# Altium schematic sheet MT-PowerDispatch V1.0.0.SchDoc
size E; SheetNumber: 0; SheetTotal: 0
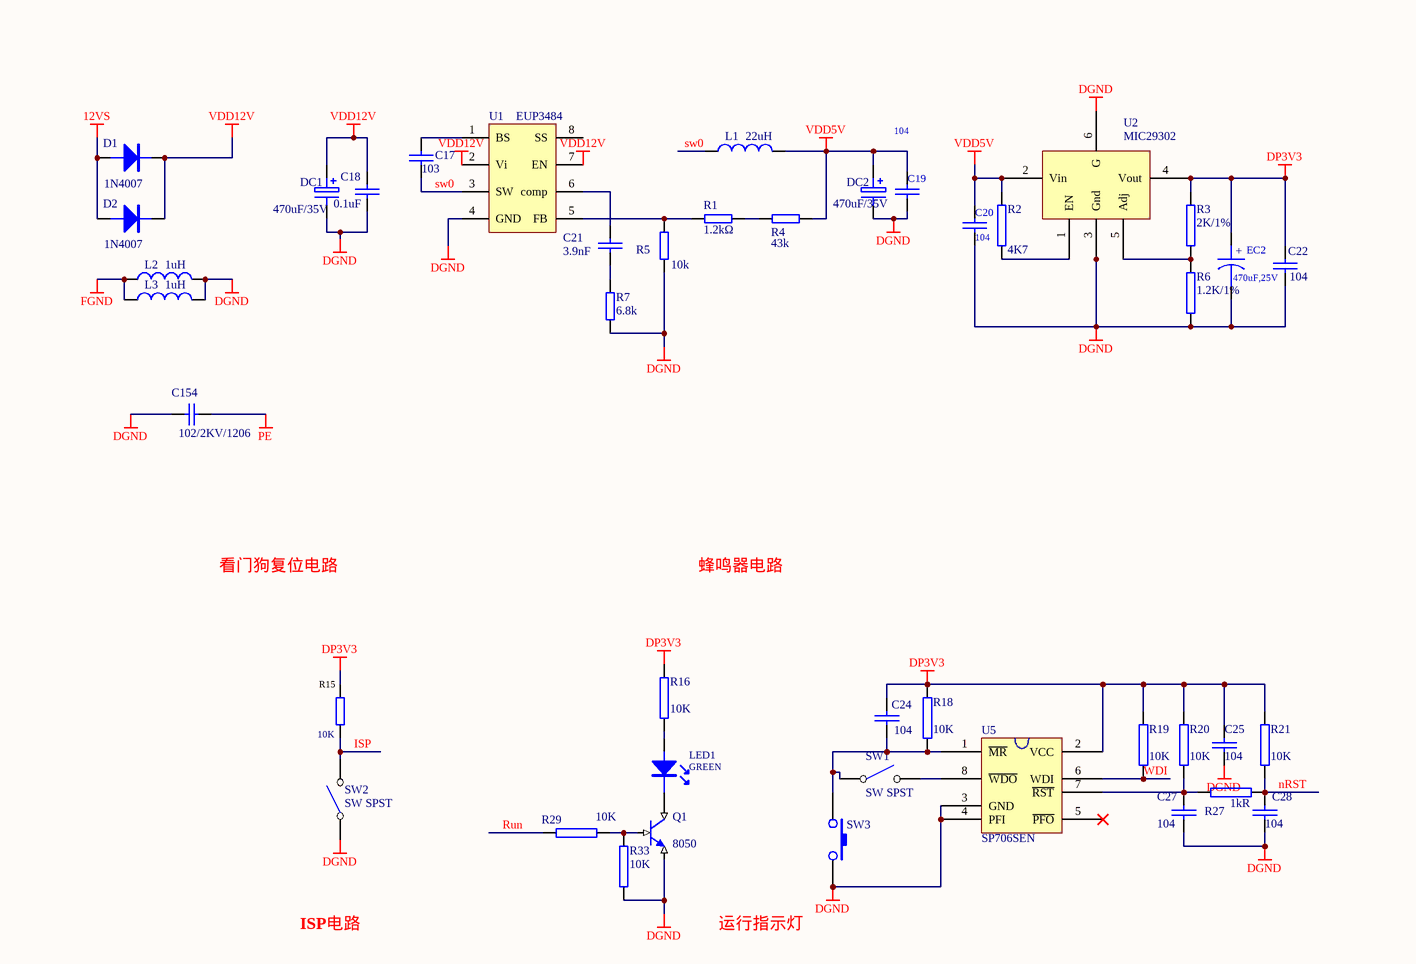
[diagram p0: MT-PowerDispatch V1.0.0.SchDoc, top left]
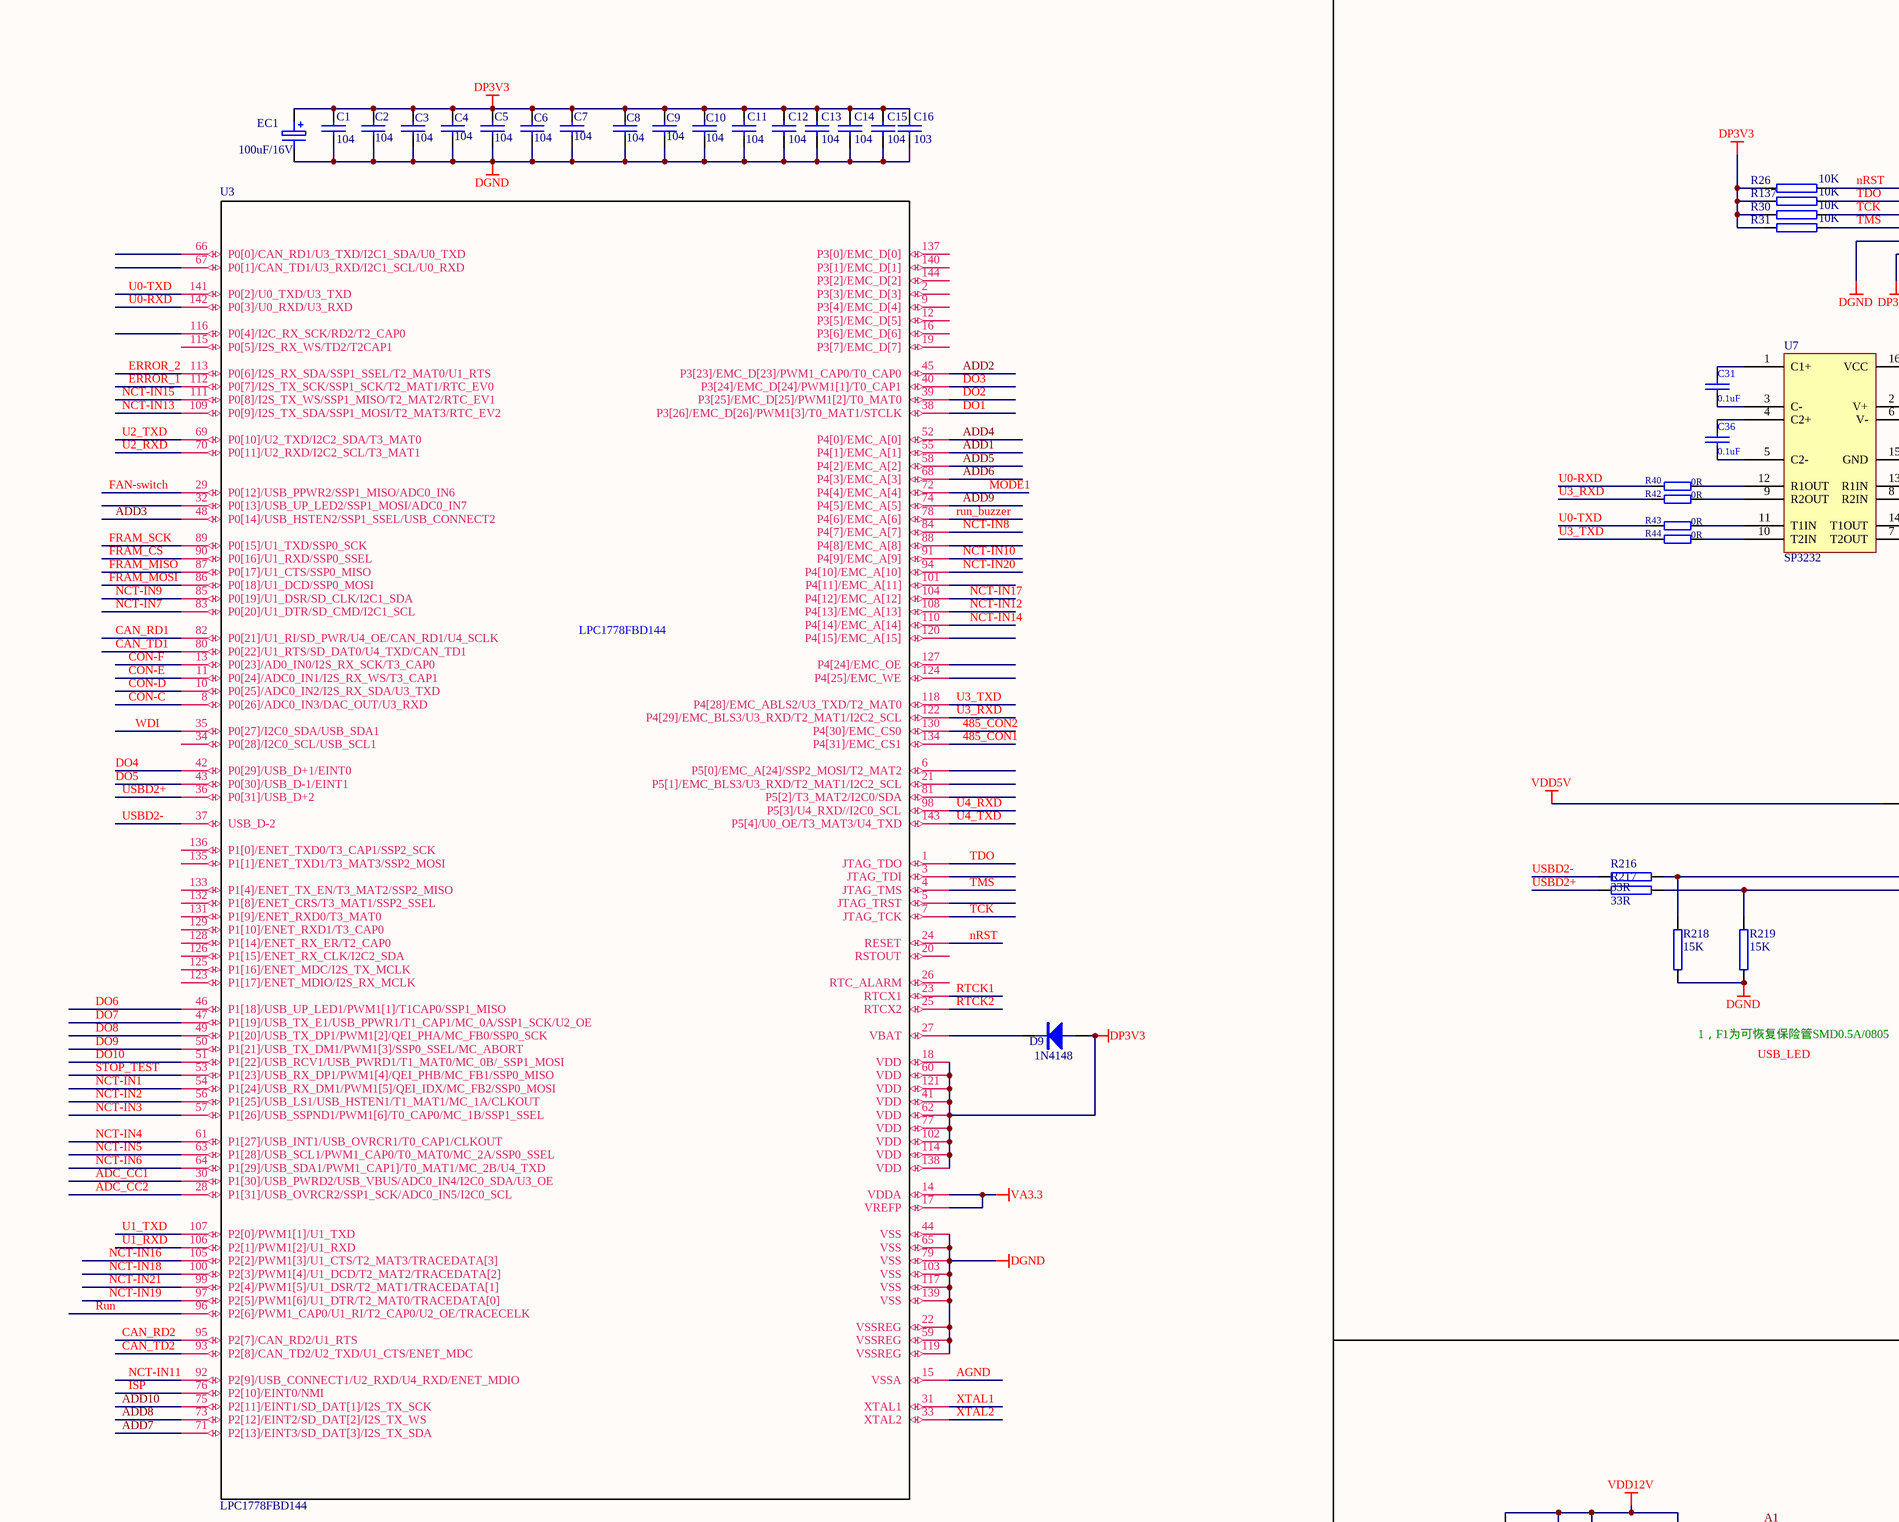
[diagram p1: MT-PowerDispatch V1.0.0.SchDoc, top middle]
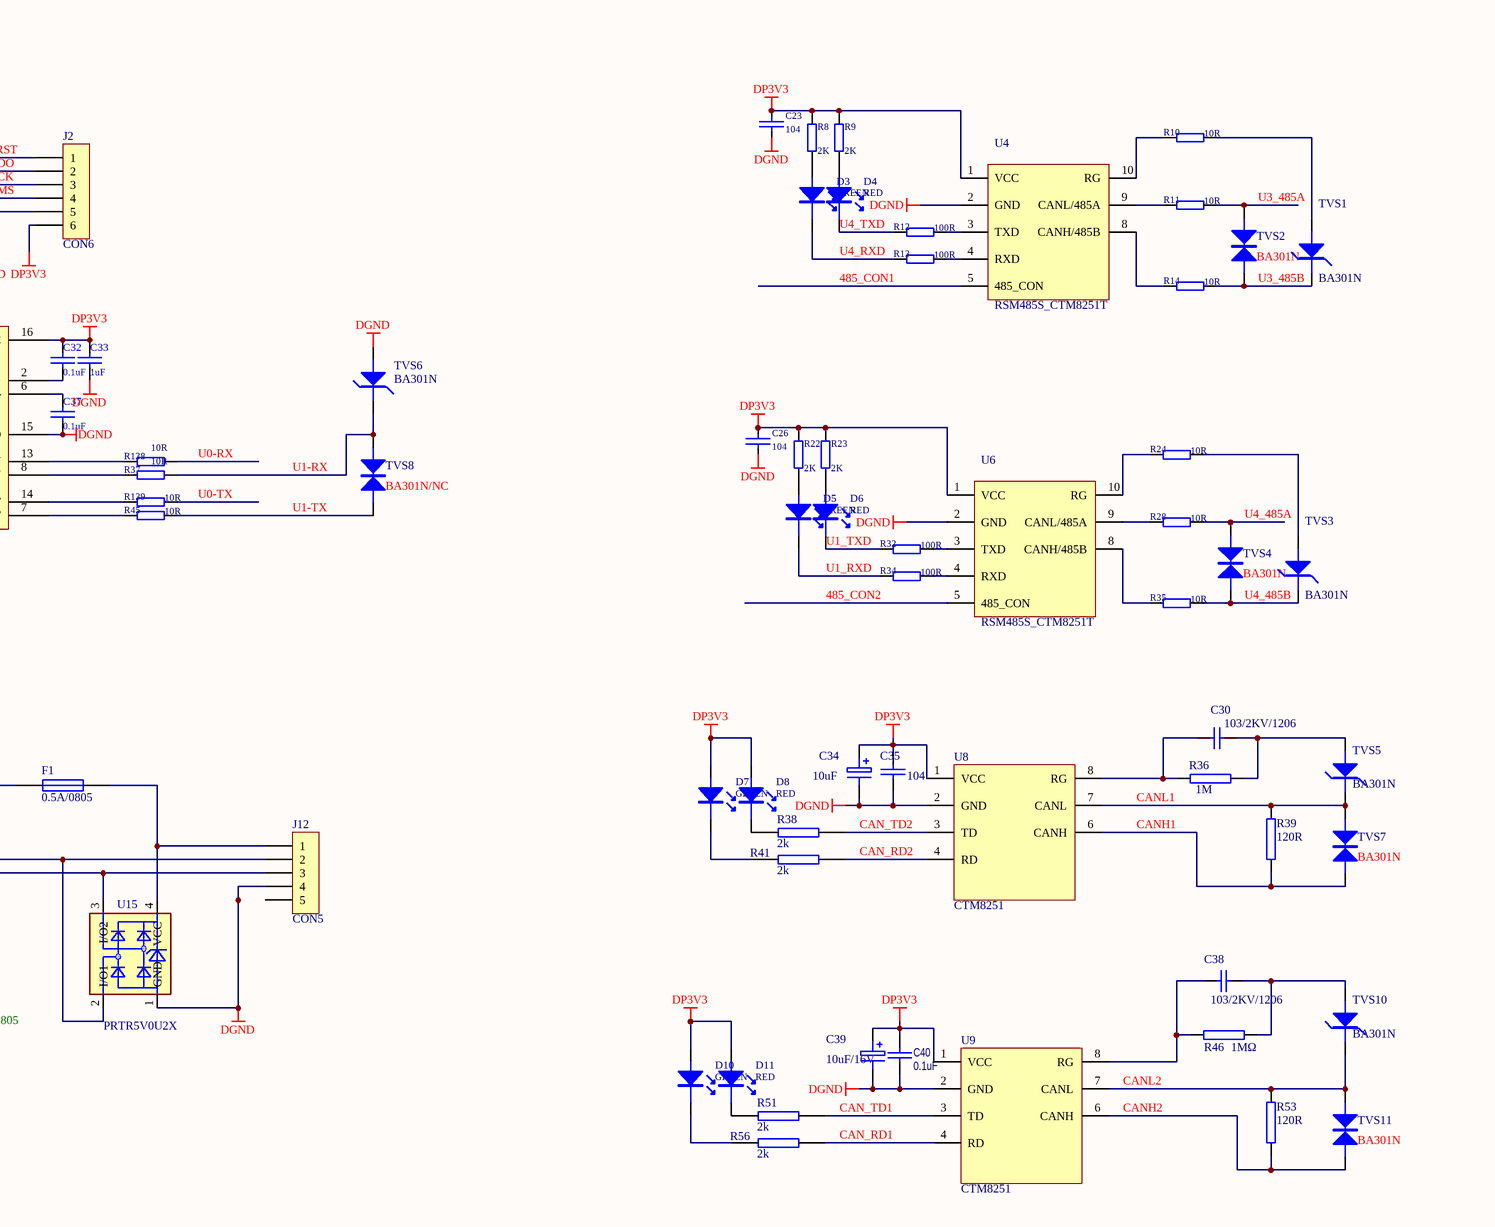
[diagram p2: MT-PowerDispatch V1.0.0.SchDoc, top right]
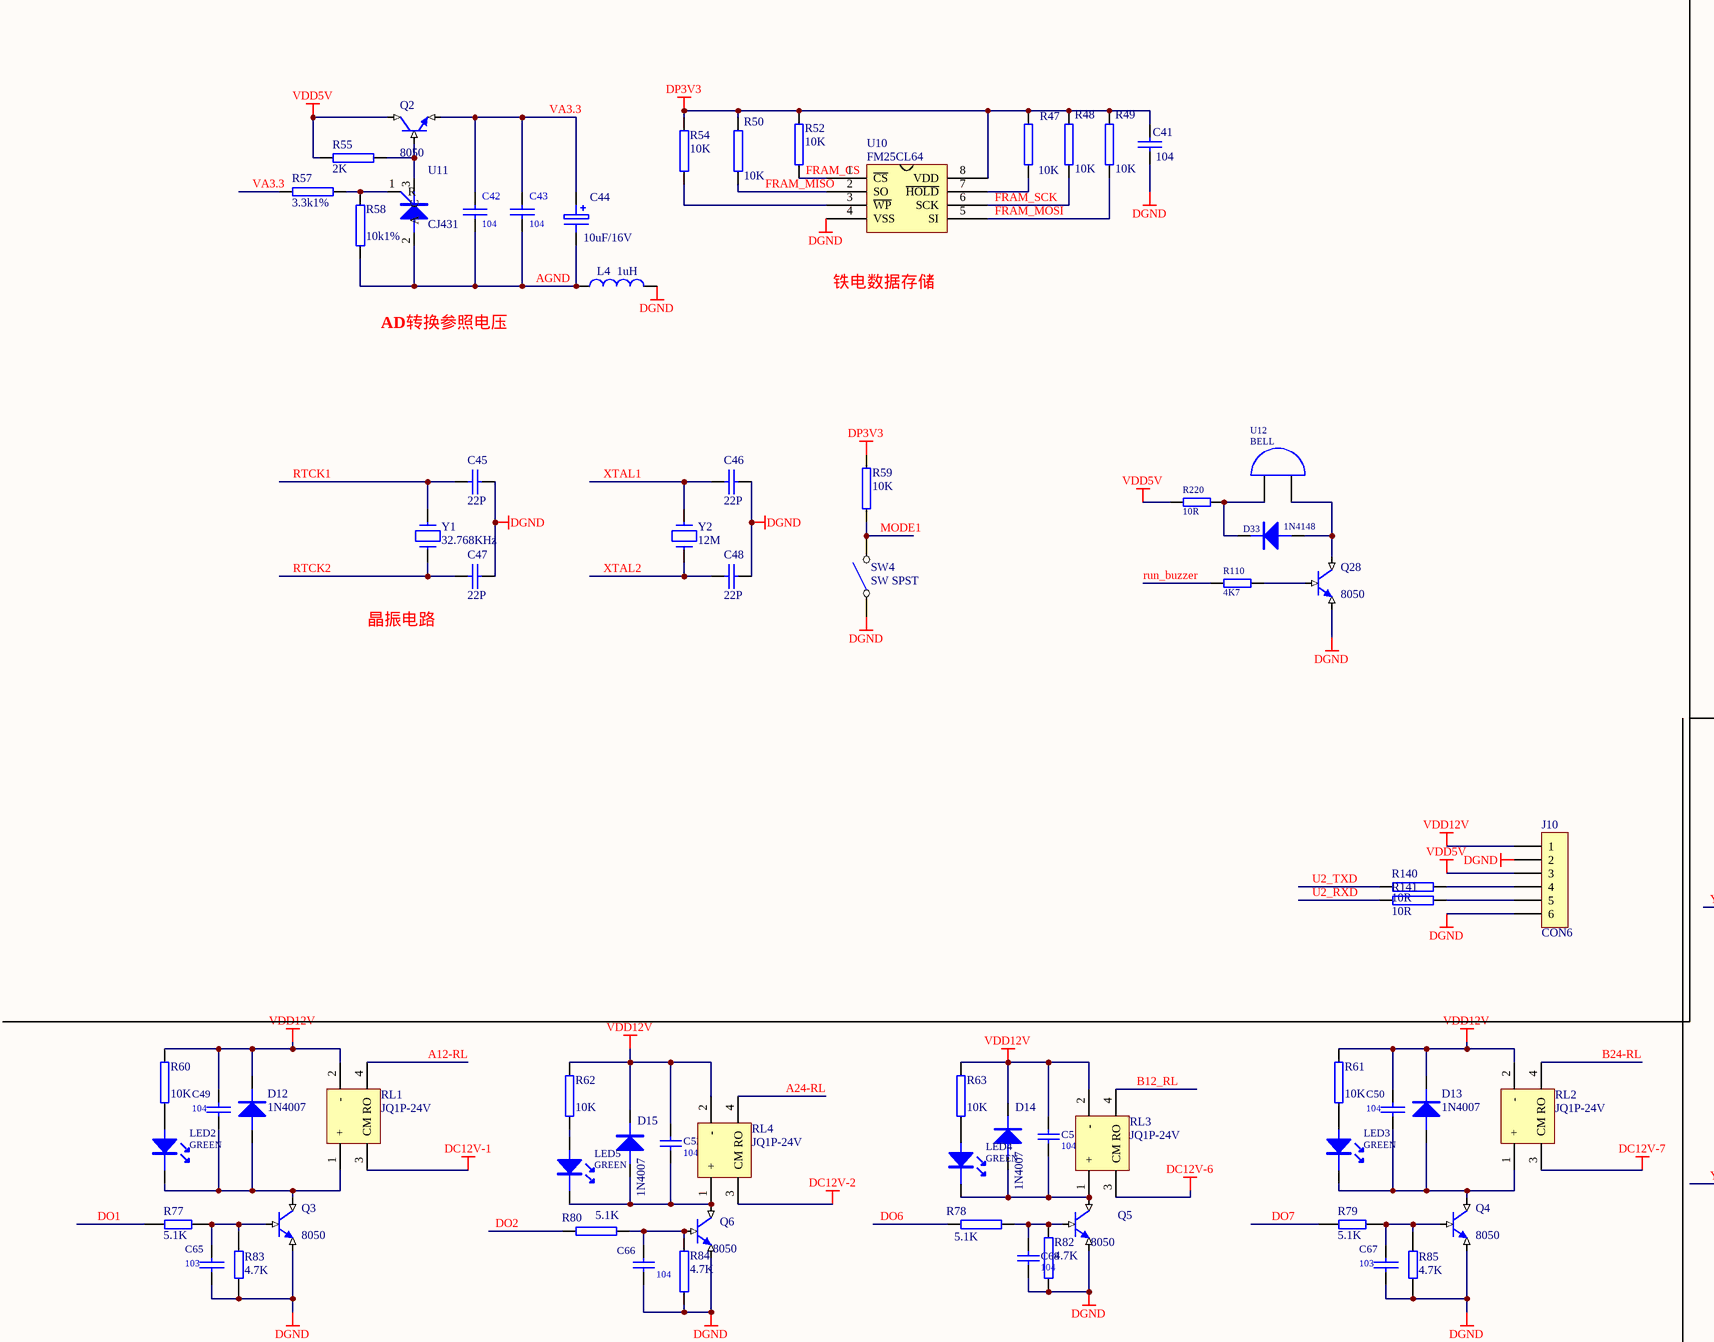
[diagram p3: MT-PowerDispatch V1.0.0.SchDoc, centre left]
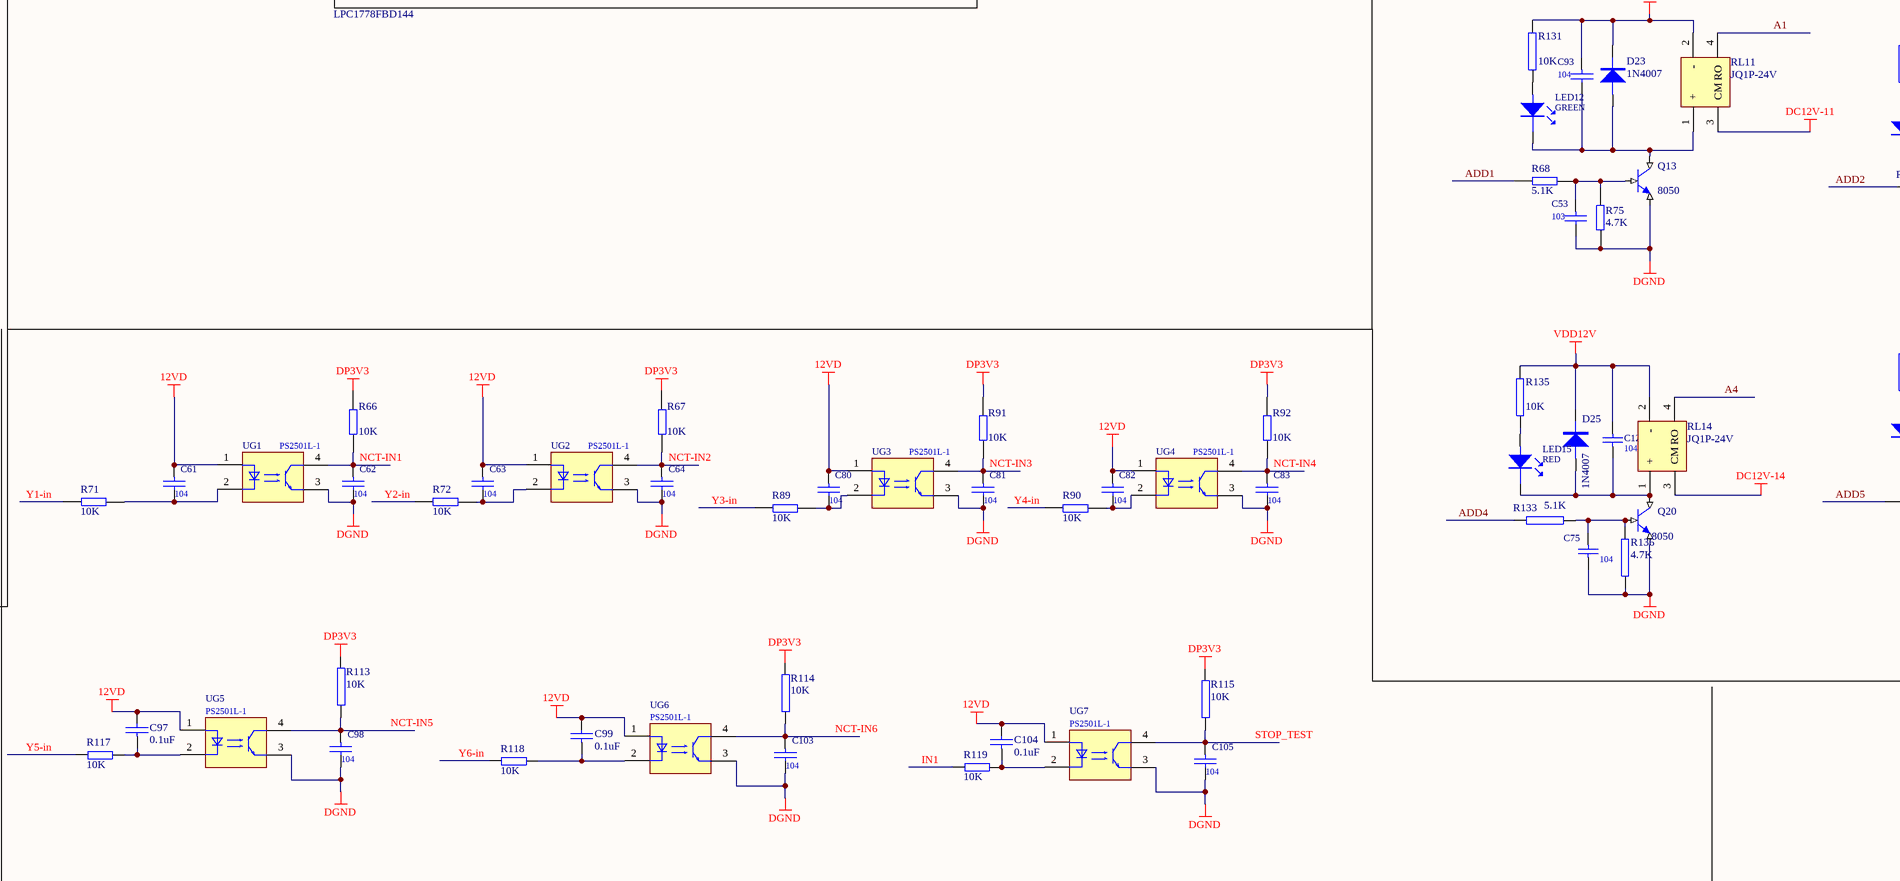
[diagram p4: MT-PowerDispatch V1.0.0.SchDoc, centre middle]
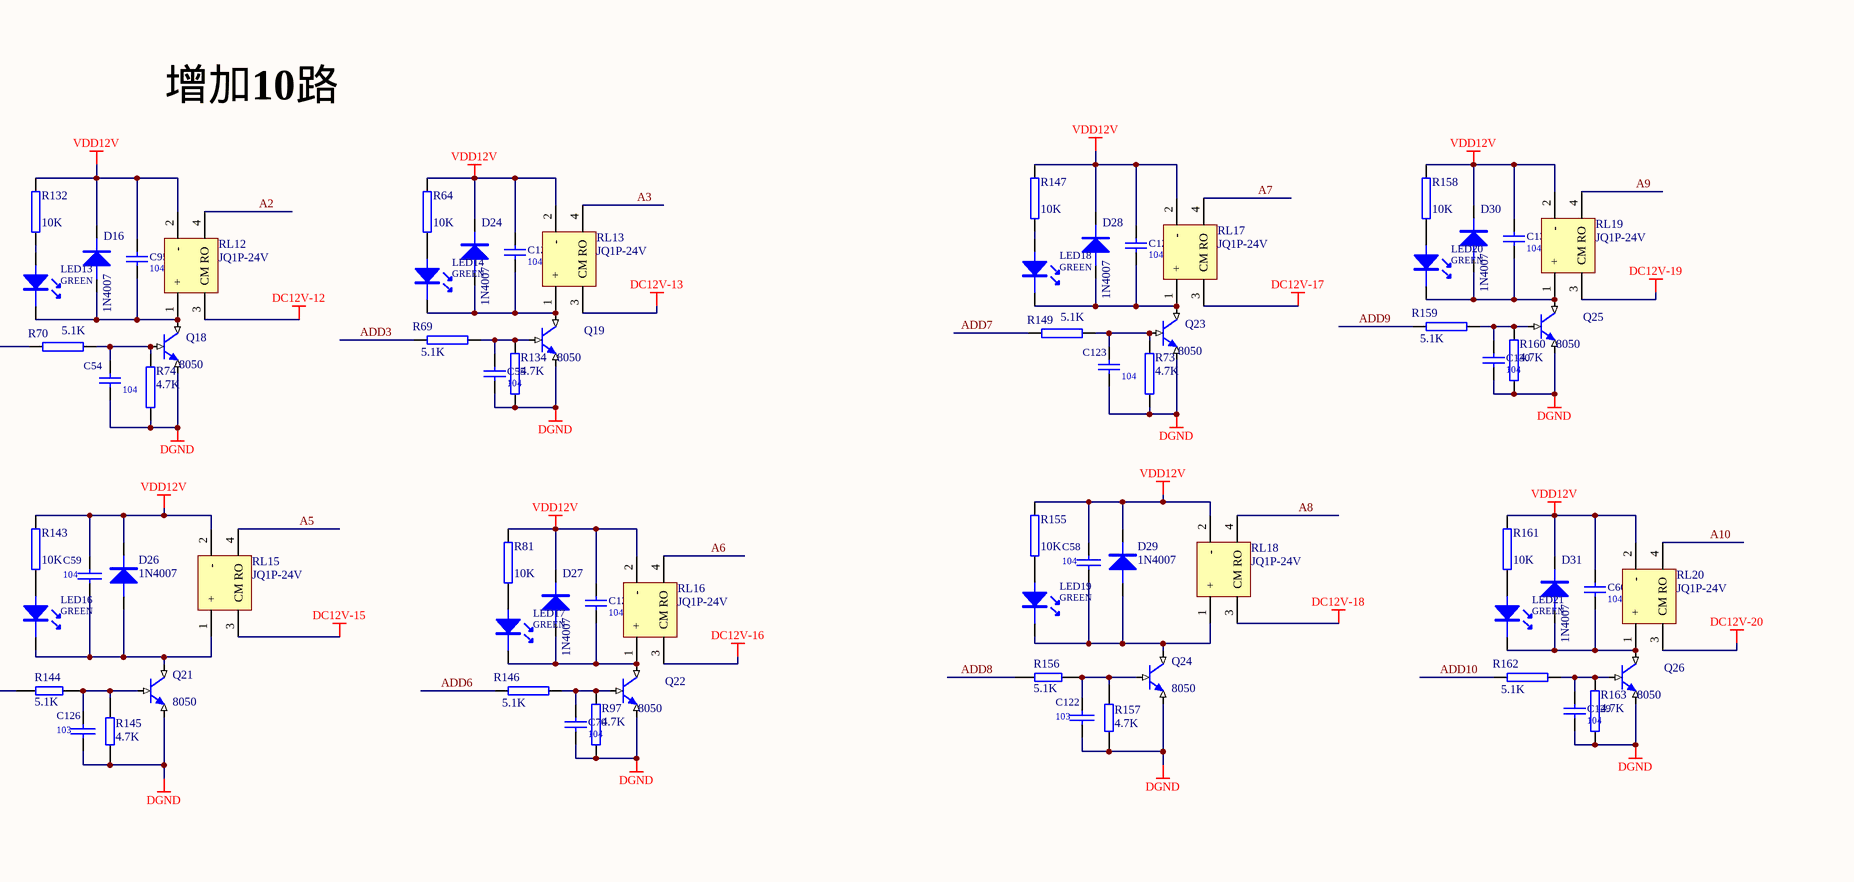
[diagram p5: MT-PowerDispatch V1.0.0.SchDoc, centre right]
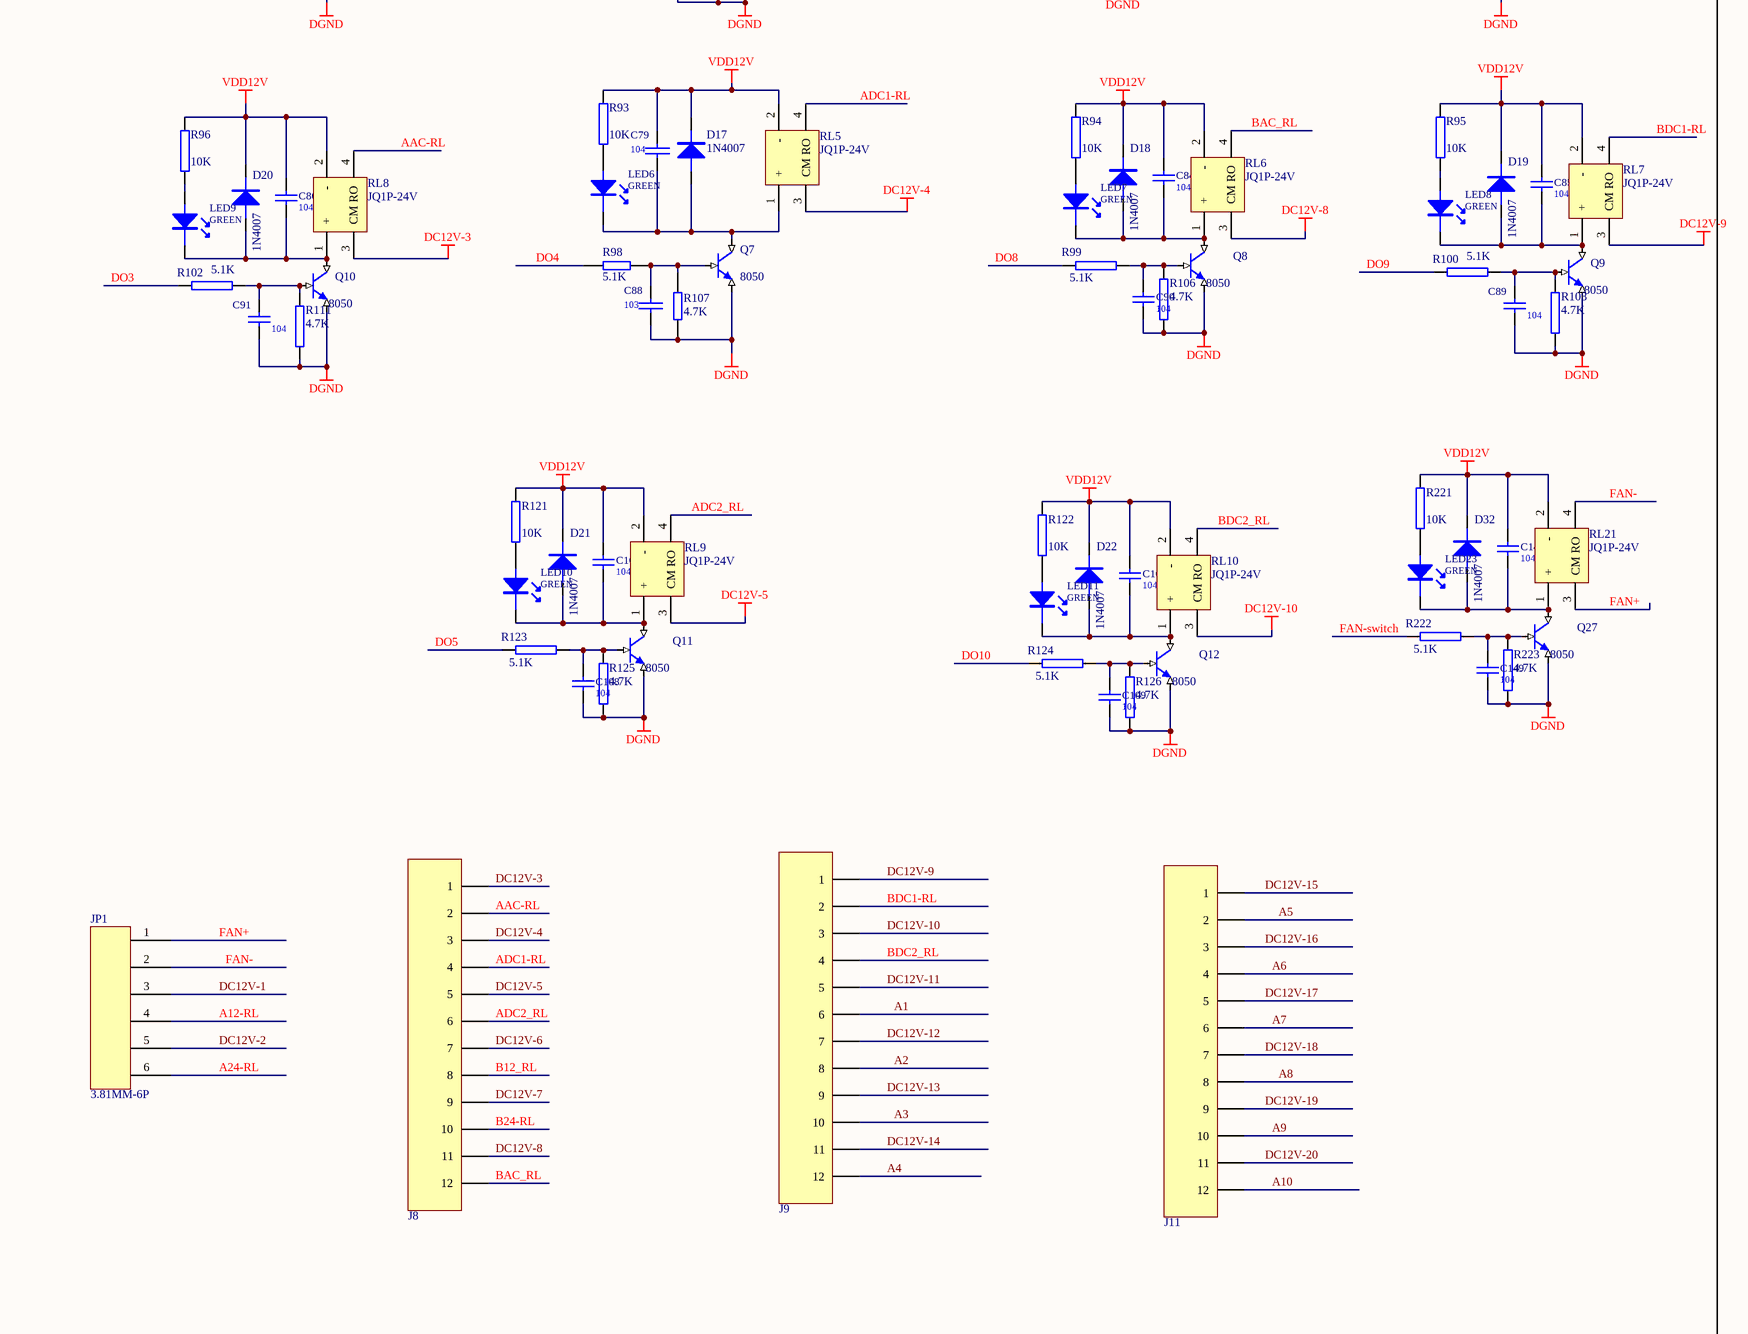
[diagram p6: MT-PowerDispatch V1.0.0.SchDoc, bottom left]
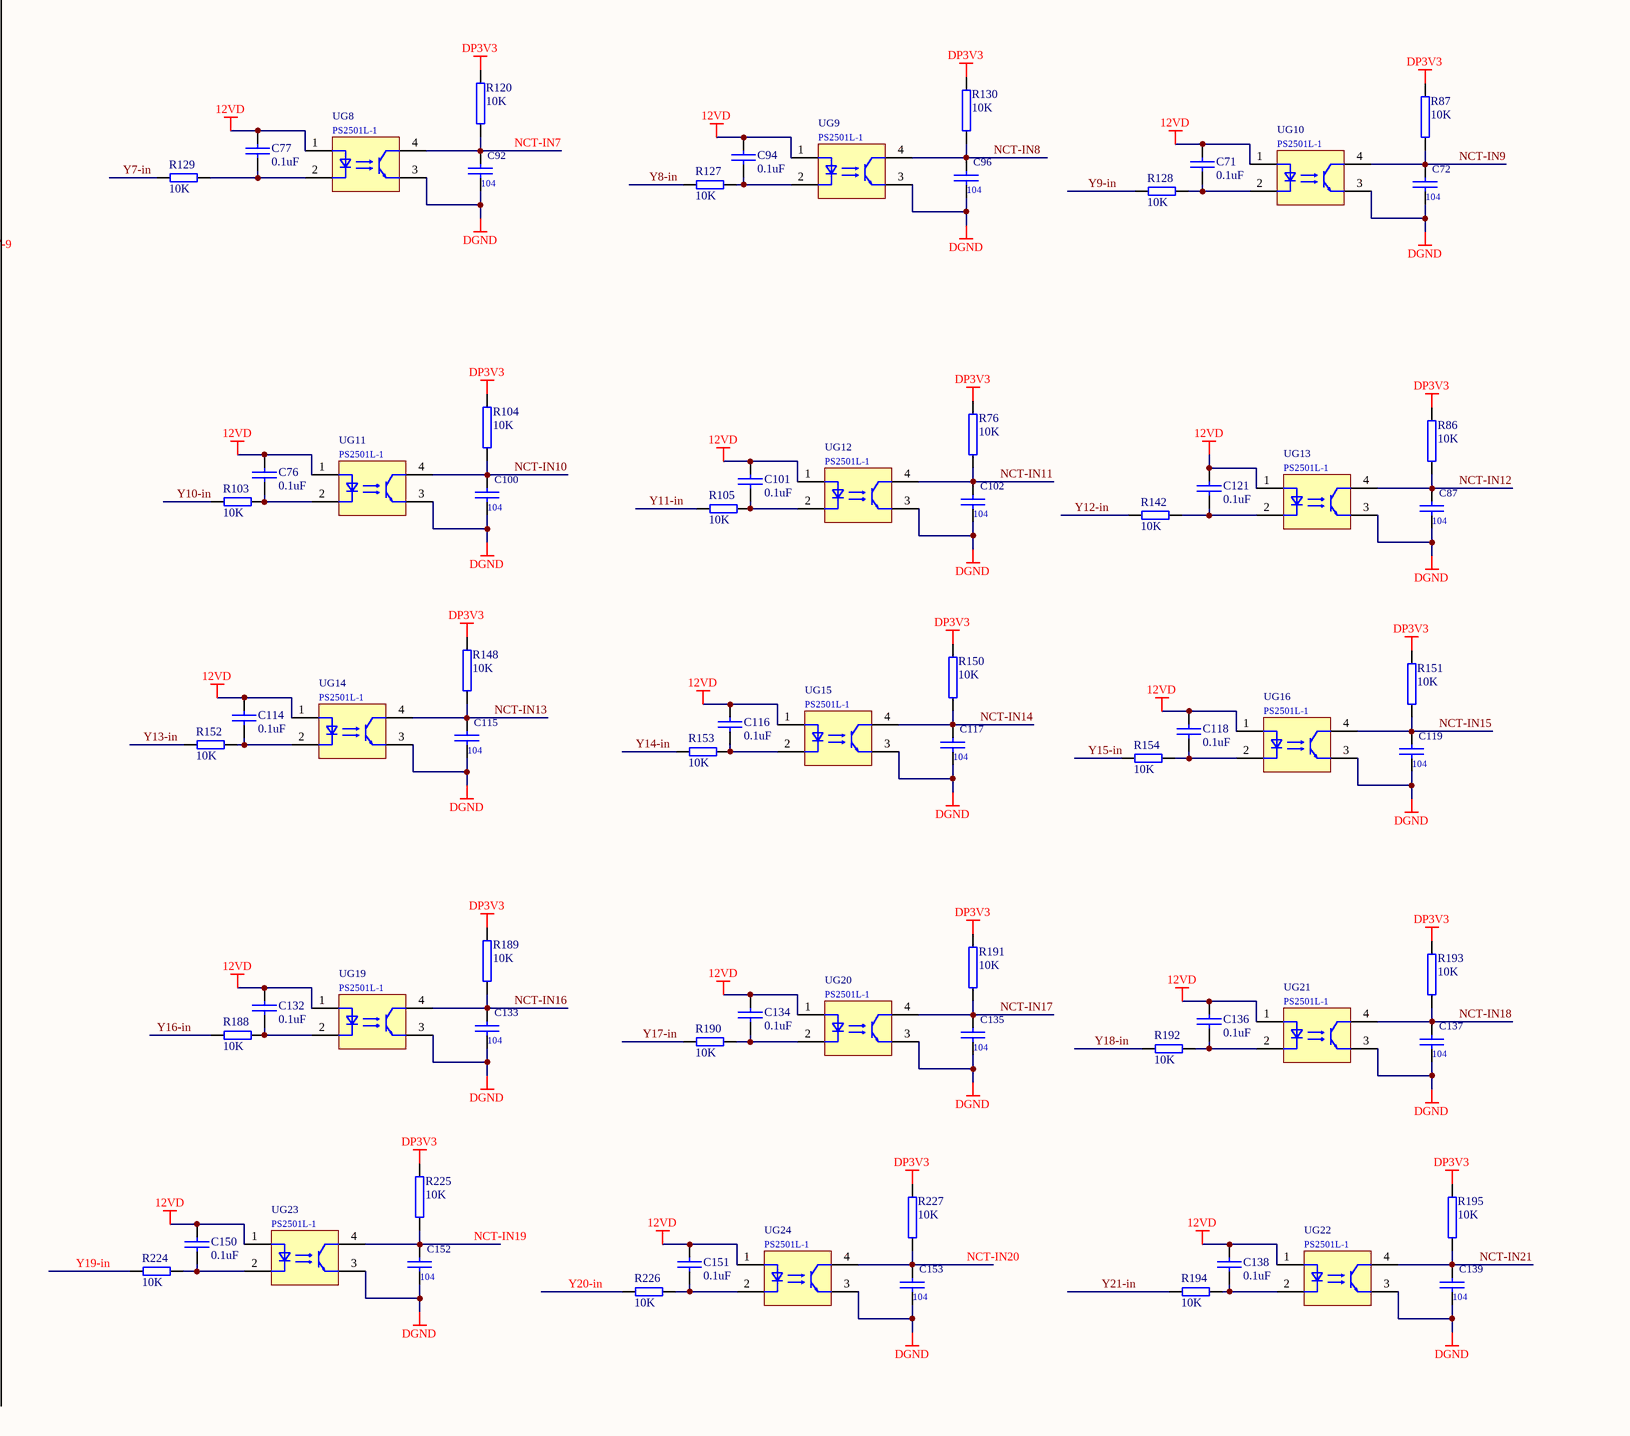
[diagram p7: MT-PowerDispatch V1.0.0.SchDoc, bottom middle]
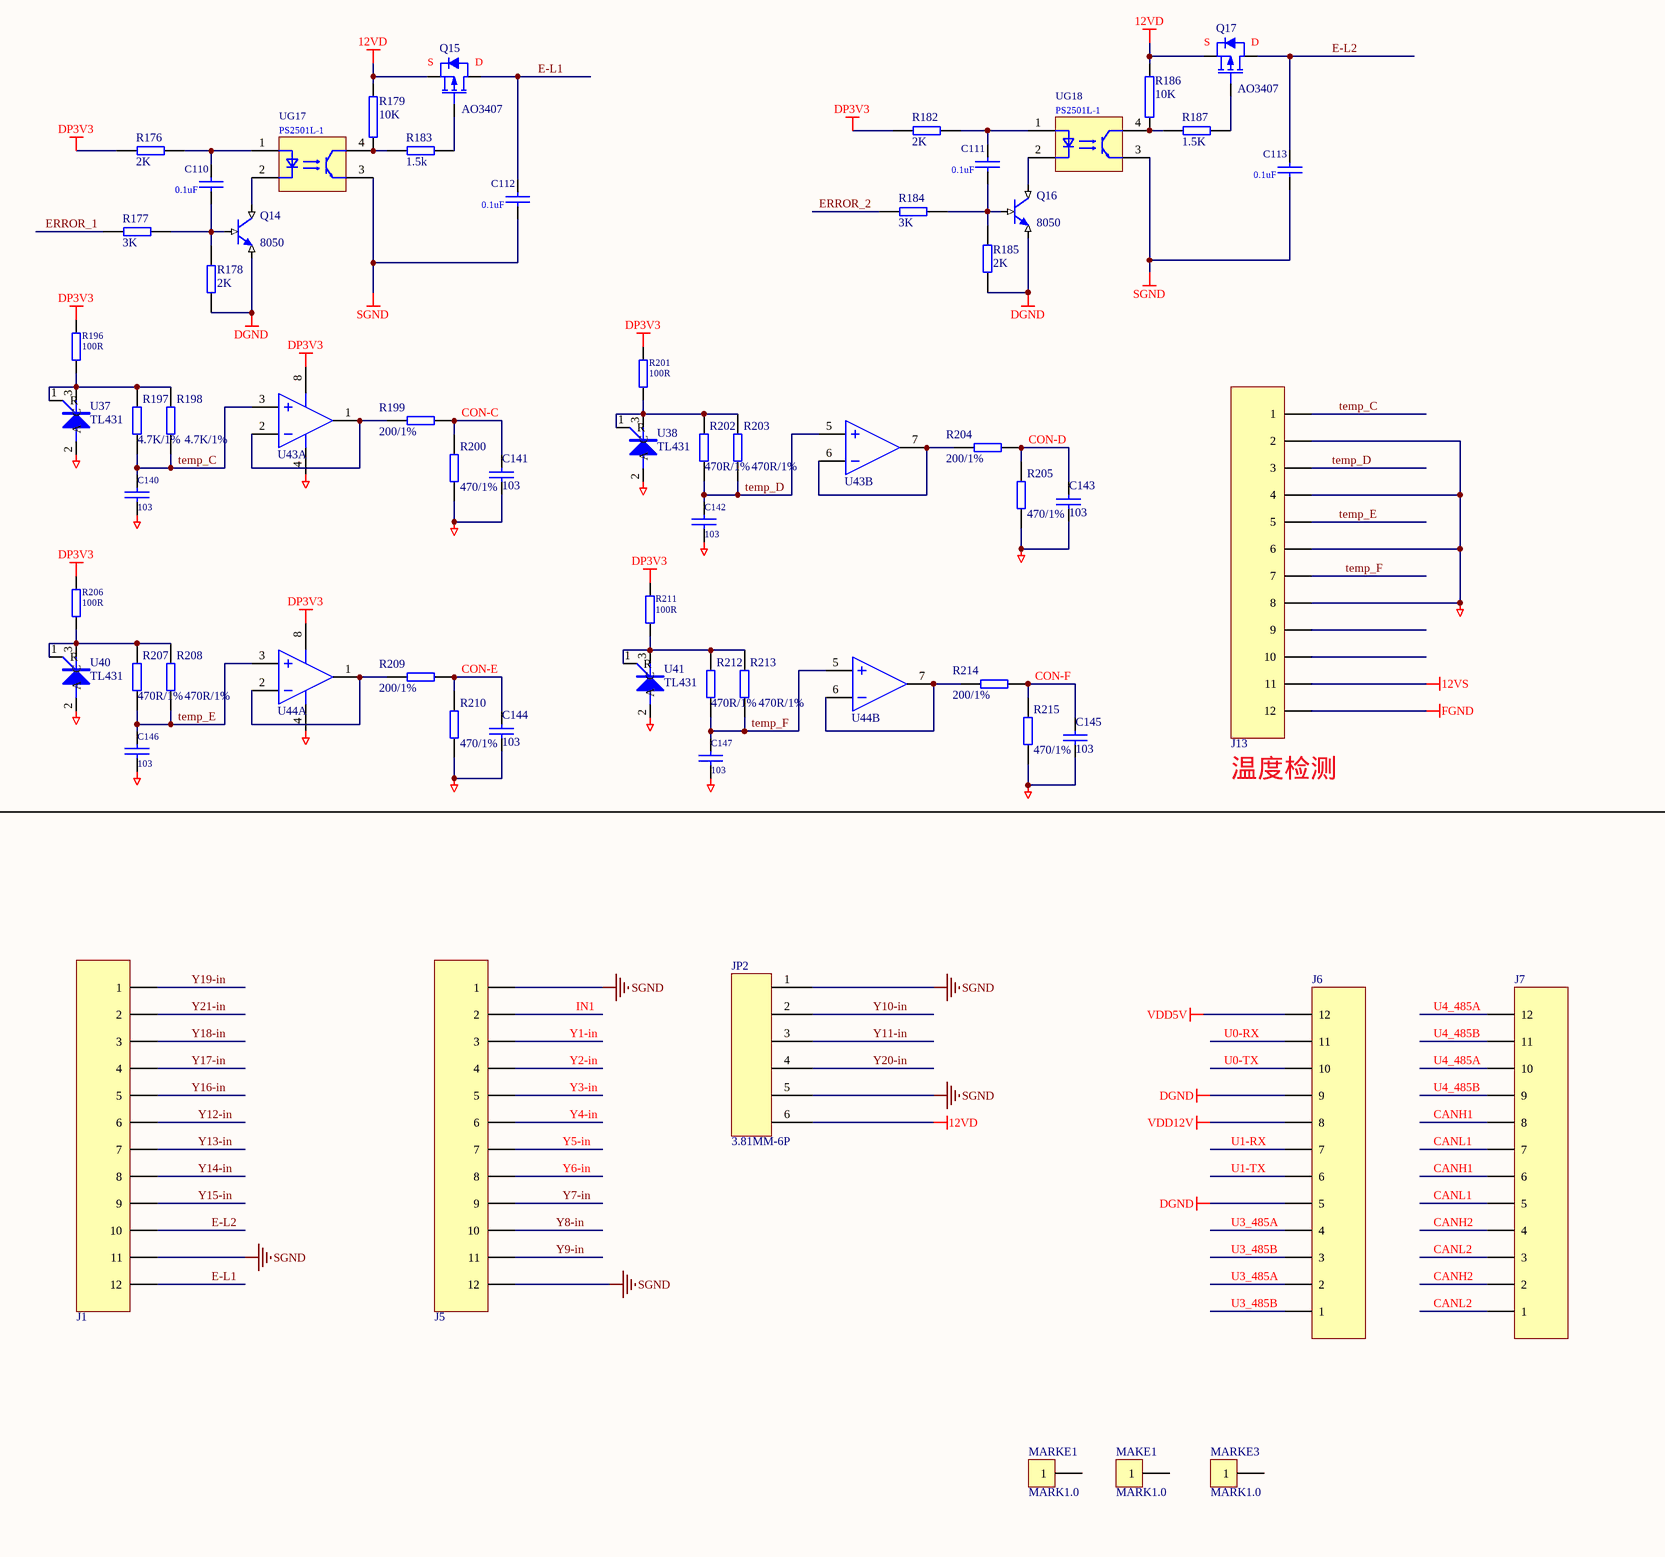
[diagram p8: MT-PowerDispatch V1.0.0.SchDoc, bottom right]

## Parts
C1  104  [0603C]
C2  104  [0603C]
C3  104  [0603C]
C4  104  [0603C]
C5  104  [0603C]
C6  104  [0603C]
C7  104  [0603C]
C8  104  [0603C]
C9  104  [0603C]
C10  104  [0603C]
C11  104  [0603C]
C12  104  [0603C]
C13  104  [0603C]
C14  104  [0603C]
C15  104  [0603C]
C16  103  [0603C]
C17  103  [0603C]
C18  0.1uF  [0805C]
C19  104  [0603C]
C20  104  [0603C]
C21  3.9nF  [0603C]
C22  104  [0603C]
C23  104  [0603C]
C24  104  [0603C]
C25  104  [0603C]
C26  104  [0603C]
C27  104  [0603C]
C28  104  [0603C]
C30  103/2KV/1206  [1206C]
C31  0.1uF  [0603C]
C32  0.1uF  [0603C]
C33  1uF  [0603C]
C34  10uF  [CA1206]
C35  104  [0603C]
C36  0.1uF  [0603C]
C37  0.1uF  [0603C]
C38  103/2KV/1206  [1206C]
C39  10uF/16V  [CA1206]
C40  0.1uF  [0603C]
C41  104  [0603C]
C42  104  [0603C]
C43  104  [0603C]
C44  10uF/16V  [CA1206]
C45  22P  [0603C]
C46  22P  [0603C]
C47  22P  [0603C]
C48  22P  [0603C]
C49  104  [0603C]
C50  104  [0603C]
C51  104  [0603C]
C52  104  [0603C]
C53  103  [0603C]
C54  104  [0603C]
C55  104  [0603C]
C58  104  [0603C]
C59  104  [0603C]
C60  104  [0603C]
C61  104  [0603C]
C62  104  [0603C]
C63  104  [0603C]
C64  104  [0603C]
C65  103  [0603C]
C66  104  [0603C]
C67  103  [0603C]
C68  104  [0603C]
C70  104  [0603C]
C71  0.1uF  [0603C]
C72  104  [0603C]
C75  104  [0603C]
C76  0.1uF  [0603C]
C77  0.1uF  [0603C]
C79  104  [0603C]
C80  104  [0603C]
C81  104  [0603C]
C82  104  [0603C]
C83  104  [0603C]
C84  104  [0603C]
C85  104  [0603C]
C86  104  [0603C]
C87  104  [0603C]
C88  103  [0603C]
C89  104  [0603C]
C90  104  [0603C]
C91  104  [0603C]
C92  104  [0603C]
C93  104  [0603C]
C94  0.1uF  [0603C]
C95  104  [0603C]
C96  104  [0603C]
C97  0.1uF  [0603C]
C98  104  [0603C]
C99  0.1uF  [0603C]
C100  104  [0603C]
C101  0.1uF  [0603C]
C102  104  [0603C]
C103  104  [0603C]
C104  0.1uF  [0603C]
C105  104  [0603C]
C106  104  [0603C]
C107  104  [0603C]
C108  104  [0603C]
C109  104  [0603C]
C110  0.1uF  [0603C]
C111  0.1uF  [0603C]
C112  0.1uF  [0603C]
C113  0.1uF  [0603C]
C114  0.1uF  [0603C]
C115  104  [0603C]
C116  0.1uF  [0603C]
C117  104  [0603C]
C118  0.1uF  [0603C]
C119  104  [0603C]
C121  0.1uF  [0603C]
C122  103  [0603C]
C123  104  [0603C]
C124  104  [0603C]
C125  104  [0603C]
C126  103  [0603C]
C127  104  [0603C]
C128  104  [0603C]
C129  104  [0603C]
C130  104  [0603C]
C131  104  [0603C]
C132  0.1uF  [0603C]
C133  104  [0603C]
C134  0.1uF  [0603C]
C135  104  [0603C]
C136  0.1uF  [0603C]
C137  104  [0603C]
C138  0.1uF  [0603C]
C139  104  [0603C]
C140  103  [0603C]
C141  103  [0603C]
C142  103  [0603C]
C143  103  [0603C]
C144  103  [0603C]
C145  103  [0603C]
C146  103  [0603C]
C147  103  [0603C]
C148  104  [0603C]
C149  104  [0603C]
C150  0.1uF  [0603C]
C151  0.1uF  [0603C]
C152  104  [0603C]
C153  104  [0603C]
C154  102/2KV/1206  [1206C]
D1  1N4007  [1206D]
D2  1N4007  [1206D]
D3  GREEN  [D0805]
D4  RED  [D0805]
D5  GREEN  [D0805]
D6  RED  [D0805]
D7  GREEN  [D0805]
D8  RED  [D0805]
D9  1N4148  [1206D]
D10  GREEN  [D0805]
D11  RED  [D0805]
D12  1N4007  [1206D]
D13  1N4007  [1206D]
D14  1N4007  [1206D]
D15  1N4007  [1206D]
D16  1N4007  [1206D]
D17  1N4007  [1206D]
D18  1N4007  [1206D]
D19  1N4007  [1206D]
D20  1N4007  [1206D]
D21  1N4007  [1206D]
D22  1N4007  [1206D]
D23  1N4007  [1206D]
D24  1N4007  [1206D]
D25  1N4007  [1206D]
D26  1N4007  [1206D]
D27  1N4007  [1206D]
D28  1N4007  [1206D]
D29  1N4007  [1206D]
D30  1N4007  [1206D]
D31  1N4007  [1206D]
D32  1N4007  [1206D]
D33  1N4148  [1206D]
DC1  470uF/35V  [C470UF25VEJ]
DC2  470uF/35V  [C470UF25VEJ]
EC1  100uF/16V  [C100UF16VEJ]
EC2  470uF,25V  [C470UF25VEJ]
F1  0.5A/0805  [0805R]
J1  J?  [KF2EDG-12P-3.81mm]  (value not drawn)
J2  CON6  [CON6-2.54mm-90]
J5  J?  [KF2EDG-12P-3.81mm]  (value not drawn)
J6  J?  [KF2EDG-12P-3.81mm]  (value not drawn)
J7  J?  [KF2EDG-12P-3.81mm]  (value not drawn)
J8  J?  [KF2EDG-12P-3.81mm]  (value not drawn)
J9  J?  [KF2EDG-12P-3.81mm]  (value not drawn)
J10  CON6  [CON6-2.54mm-90]
J11  J?  [KF2EDG-12P-3.81mm]  (value not drawn)
J12  CON5  [USB-A]
J13  J?  [KF2EDG-12P-3.81mm]  (value not drawn)
JP1  3.81MM-6P  [CON-3.81MM-6P]
JP2  3.81MM-6P  [CON-3.81MM-6P]
L1  22uH  [LC7*7*3_L]
L2  1uH  [1206R]
L3  1uH  [1206R]
L4  1uH  [1206R]
LED1  GREEN  [D0805]
LED2  GREEN  [D0805]
LED3  GREEN  [D0805]
LED4  GREEN  [D0805]
LED5  GREEN  [D0805]
LED6  GREEN  [D0805]
LED7  GREEN  [D0805]
LED8  GREEN  [D0805]
LED9  GREEN  [D0805]
LED10  GREEN  [D0805]
LED11  GREEN  [D0805]
LED12  GREEN  [D0805]
LED13  GREEN  [D0805]
LED14  GREEN  [D0805]
LED15  RED  [D0805]
LED16  GREEN  [D0805]
LED17  GREEN  [D0805]
LED18  GREEN  [D0805]
LED19  GREEN  [D0805]
LED20  GREEN  [D0805]
LED21  GREEN  [D0805]
LED23  GREEN  [D0805]
MAKE1  MARK1.0  [MARK1.0]
MARKE1  MARK1.0  [MARK1.0]
MARKE3  MARK1.0  [MARK1.0]
Q1  8050  [SOT23]
Q2  8050  [SOT23]
Q3  8050  [SOT23]
Q4  8050  [SOT23]
Q5  8050  [SOT23]
Q6  8050  [SOT23]
Q7  8050  [SOT23]
Q8  8050  [SOT23]
Q9  8050  [SOT23]
Q10  8050  [SOT23]
Q11  8050  [SOT23]
Q12  8050  [SOT23]
Q13  8050  [SOT23]
Q14  8050  [SOT23]
Q15  AO3407  [SOT-23L]
Q16  8050  [SOT23]
Q17  AO3407  [SOT-23L]
Q18  8050  [SOT23]
Q19  8050  [SOT23]
Q20  8050  [SOT23]
Q21  8050  [SOT23]
Q22  8050  [SOT23]
Q23  8050  [SOT23]
Q24  8050  [SOT23]
Q25  8050  [SOT23]
Q26  8050  [SOT23]
Q27  8050  [SOT23]
Q28  8050  [SOT23]
R1  1.2kΩ  [0603R]
R2  4K7  [0603R]
R3  2K/1%  [0603R]
R4  43k  [0603R]
R5  10k  [0603R]
R6  1.2K/1%  [0603R]
R7  6.8k  [0603R]
R8  2K  [0603R]
R9  2K  [0603R]
R10  10R  [0603R]
R11  10R  [0603R]
R12  100R  [0603R]
R13  100R  [0603R]
R14  10R  [0603R]
R15  10K  [0603R]
R16  10K  [0603R]
R18  10K  [0603R]
R19  10K  [0603R]
R20  10K  [0603R]
R21  10K  [0603R]
R22  2K  [0603R]
R23  2K  [0603R]
R24  10R  [0603R]
R26  10K  [0603R]
R27  1kR  [0603R]
R28  10R  [0603R]
R29  10K  [0603R]
R30  10K  [0603R]
R31  10K  [0603R]
R32  100R  [0603R]
R33  10K  [0603R]
R34  100R  [0603R]
R35  10R  [0603R]
R36  1M  [1206R]
R37  10R  [0603R]
R38  2k  [0603R]
R39  120R  [1206R]
R40  0R  [0603R]
R41  2k  [0603R]
R42  0R  [0603R]
R43  0R  [0603R]
R44  0R  [0603R]
R45  10R  [0603R]
R46  value 1MΩ  [1206R]  (hidden comment: 1M)
R47  10K  [0603R]
R48  10K  [0603R]
R49  10K  [0603R]
R50  10K  [0603R]
R51  2k  [0603R]
R52  10K  [0603R]
R53  120R  [1206R]
R54  10K  [0603R]
R55  2K  [0603R]
R56  2k  [0603R]
R57  3.3k1%  [0603R]
R58  10k1%  [0603R]
R59  10K  [0603R]
R60  10K  [0603R]
R61  10K  [0603R]
R62  10K  [0603R]
R63  10K  [0603R]
R64  10K  [0603R]
R66  10K  [0603R]
R67  10K  [0603R]
R68  5.1K  [0603R]
R69  5.1K  [0603R]
R70  5.1K  [0603R]
R71  10K  [0603R]
R72  10K  [0603R]
R73  4.7K  [0603R]
R74  4.7K  [0603R]
R75  4.7K  [0603R]
R76  10K  [0603R]
R77  5.1K  [0603R]
R78  5.1K  [0603R]
R79  5.1K  [0603R]
R80  5.1K  [0603R]
R81  10K  [0603R]
R82  4.7K  [0603R]
R83  4.7K  [0603R]
R84  4.7K  [0603R]
R85  4.7K  [0603R]
R86  10K  [0603R]
R87  10K  [0603R]
R89  10K  [0603R]
R90  10K  [0603R]
R91  10K  [0603R]
R92  10K  [0603R]
R93  10K  [0603R]
R94  10K  [0603R]
R95  10K  [0603R]
R96  10K  [0603R]
R97  4.7K  [0603R]
R98  5.1K  [0603R]
R99  5.1K  [0603R]
R100  5.1K  [0603R]
R102  5.1K  [0603R]
R103  10K  [0603R]
R104  10K  [0603R]
R105  10K  [0603R]
R106  4.7K  [0603R]
R107  4.7K  [0603R]
R108  4.7K  [0603R]
R110  4K7  [0603R]
R111  4.7K  [0603R]
R113  10K  [0603R]
R114  10K  [0603R]
R115  10K  [0603R]
R117  10K  [0603R]
R118  10K  [0603R]
R119  10K  [0603R]
R120  10K  [0603R]
R121  10K  [0603R]
R122  10K  [0603R]
R123  5.1K  [0603R]
R124  5.1K  [0603R]
R125  4.7K  [0603R]
R126  4.7K  [0603R]
R127  10K  [0603R]
R128  10K  [0603R]
R129  10K  [0603R]
R130  10K  [0603R]
R131  10K  [0603R]
R132  10K  [0603R]
R133  5.1K  [0603R]
R134  4.7K  [0603R]
R135  10K  [0603R]
R136  4.7K  [0603R]
R137  10K  [0603R]
R138  10R  [0603R]
R139  10R  [0603R]
R140  10R  [0603R]
R141  10R  [0603R]
R142  10K  [0603R]
R143  10K  [0603R]
R144  5.1K  [0603R]
R145  4.7K  [0603R]
R146  5.1K  [0603R]
R147  10K  [0603R]
R148  10K  [0603R]
R149  5.1K  [0603R]
R150  10K  [0603R]
R151  10K  [0603R]
R152  10K  [0603R]
R153  10K  [0603R]
R154  10K  [0603R]
R155  10K  [0603R]
R156  5.1K  [0603R]
R157  4.7K  [0603R]
R158  10K  [0603R]
R159  5.1K  [0603R]
R160  4.7K  [0603R]
R161  10K  [0603R]
R162  5.1K  [0603R]
R163  4.7K  [0603R]
R176  2K  [0603R]
R177  3K  [0603R]
R178  2K  [0603R]
R179  10K  [0603R]
R182  2K  [0603R]
R183  1.5k  [0603R]
R184  3K  [0603R]
R185  2K  [0603R]
R186  10K  [0603R]
R187  1.5K  [0603R]
R188  10K  [0603R]
R189  10K  [0603R]
R190  10K  [0603R]
R191  10K  [0603R]
R192  10K  [0603R]
R193  10K  [0603R]
R194  10K  [0603R]
R195  10K  [0603R]
R196  100R  [0603R]
R197  4.7K/1%  [0603R]
R198  4.7K/1%  [0603R]
R199  200/1%  [0603R]
R200  470/1%  [0603R]
R201  100R  [0603R]
R202  470R/1%  [0603R]
R203  470R/1%  [0603R]
R204  200/1%  [0603R]
R205  470/1%  [0603R]
R206  100R  [0603R]
R207  470R/1%  [0603R]
R208  470R/1%  [0603R]
R209  200/1%  [0603R]
R210  470/1%  [0603R]
R211  100R  [0603R]
R212  470R/1%  [0603R]
R213  470R/1%  [0603R]
R214  200/1%  [0603R]
R215  470/1%  [0603R]
R216  33R  [0603R]
R217  33R  [0603R]
R218  15K  [0603R]
R219  15K  [0603R]
R220  10R  [0603R]
R221  10K  [0603R]
R222  5.1K  [0603R]
R223  4.7K  [0603R]
R224  10K  [0603R]
R225  10K  [0603R]
R226  10K  [0603R]
R227  10K  [0603R]
RL1  JQ1P-24V  [HF32F-12V]
RL2  JQ1P-24V  [HF32F-12V]
RL3  JQ1P-24V  [HF32F-12V]
RL4  JQ1P-24V  [HF32F-12V]
RL5  JQ1P-24V  [HF32F-12V]
RL6  JQ1P-24V  [HF32F-12V]
RL7  JQ1P-24V  [HF32F-12V]
RL8  JQ1P-24V  [HF32F-12V]
RL9  JQ1P-24V  [HF32F-12V]
RL10  JQ1P-24V  [HF32F-12V]
RL11  JQ1P-24V  [HF32F-12V]
RL12  JQ1P-24V  [HF32F-12V]
RL13  JQ1P-24V  [HF32F-12V]
RL14  JQ1P-24V  [HF32F-12V]
RL15  JQ1P-24V  [HF32F-12V]
RL16  JQ1P-24V  [HF32F-12V]
RL17  JQ1P-24V  [HF32F-12V]
RL18  JQ1P-24V  [HF32F-12V]
RL19  JQ1P-24V  [HF32F-12V]
RL20  JQ1P-24V  [HF32F-12V]
RL21  JQ1P-24V  [HF32F-12V]
SW1  SW SPST  [SW1]
SW2  SW SPST  [SW1]
SW3  按键  [SW]  (value not drawn)
SW4  SW SPST  [SW1]
TVS1  BA301N  [3528TVS]
TVS2  BA301N  [3528TVS]
TVS3  BA301N  [3528TVS]
TVS4  BA301N  [3528TVS]
TVS5  BA301N  [3528TVS]
TVS6  BA301N  [3528TVS]
TVS7  BA301N  [3528TVS]
TVS8  BA301N/NC  [3528TVS]
TVS10  BA301N  [3528TVS]
TVS11  BA301N  [3528TVS]
U1  EUP3484  [SOP-8]
U2  MIC29302  [TO5B]
U3  LPC1778FBD144  [LC-LQFP-144_20x20x05P]
U4  RSM485S_CTM8251T  [RSM485]
U5  SP706SEN  [SOP8]
U6  RSM485S_CTM8251T  [RSM485]
U7  SP3232  [SO-16]
U8  CTM8251  [CTM8251KT]
U9  CTM8251  [CTM8251KT]
U10  FM25CL64  [SOP8]
U11  CJ431  [SOT23]
U12  BELL  [BUZ]
U15  PRTR5V0U2X  [SOT-143B]
U37  TL431  [SOT23]
U38  TL431  [SOT23]
U40  TL431  [SOT23]
U41  TL431  [SOT23]
U43  LM258  [SOP8]  (value not drawn)  (parts A,B of 2)
U44  LM258  [SOP8]  (value not drawn)  (parts A,B of 2)
UG1  PS2501L-1  [DIP-4]
UG2  PS2501L-1  [DIP-4]
UG3  PS2501L-1  [DIP-4]
UG4  PS2501L-1  [DIP-4]
UG5  PS2501L-1  [DIP-4]
UG6  PS2501L-1  [DIP-4]
UG7  PS2501L-1  [DIP-4]
UG8  PS2501L-1  [DIP-4]
UG9  PS2501L-1  [DIP-4]
UG10  PS2501L-1  [DIP-4]
UG11  PS2501L-1  [DIP-4]
UG12  PS2501L-1  [DIP-4]
UG13  PS2501L-1  [DIP-4]
UG14  PS2501L-1  [DIP-4]
UG15  PS2501L-1  [DIP-4]
UG16  PS2501L-1  [DIP-4]
UG17  PS2501L-1  [DIP-4]
UG18  PS2501L-1  [DIP-4]
UG19  PS2501L-1  [DIP-4]
UG20  PS2501L-1  [DIP-4]
UG21  PS2501L-1  [DIP-4]
UG22  PS2501L-1  [DIP-4]
UG23  PS2501L-1  [DIP-4]
UG24  PS2501L-1  [DIP-4]
Y1  32.768KHz  [ZS-32.768]
Y2  12M  [ZS_SMD]

## Nets
12VD: C61.1 C63.1 C71.2 C76.2 C77.2 C80.1 C82.1 C94.2 C97.2 C99.2 C101.2 C104.2 C114.2 C116.2 C118.2 C121.2 C132.2 C134.2 C136.2 C138.2 C150.2 C151.2 JP2.6 Q15.3(S) Q17.3(S) R179.2 R186.2 UG1.1 UG2.1 UG3.1 UG4.1 UG5.1 UG6.1 UG7.1 UG8.1 UG9.1 UG10.1 UG11.1 UG12.1 UG13.1 UG14.1 UG15.1 UG16.1 UG19.1 UG20.1 UG21.1 UG22.1 UG23.1 UG24.1
12VS: D1.1(A) D2.1(A) J13.11
DC12V-1: JP1.3 RL1.3(CM)
DC12V-2: JP1.5 RL4.3(CM)
DC12V-3: J8.1 RL8.3(CM)
DC12V-4: J8.3 RL5.3(CM)
DC12V-5: J8.5 RL9.3(CM)
DC12V-6: J8.7 RL3.3(CM)
DC12V-7: J8.9 RL2.3(CM)
DC12V-8: J8.11 RL6.3(CM)
DC12V-9: J9.1 RL7.3(CM)
DC12V-10: J9.3 RL10.3(CM)
DC12V-11: J9.5 RL11.3(CM)
DC12V-12: J9.7 RL12.3(CM)
DC12V-13: J9.9 RL13.3(CM)
DC12V-14: J9.11 RL14.3(CM)
DC12V-15: J11.1 RL15.3(CM)
DC12V-16: J11.3 RL16.3(CM)
DC12V-17: J11.5 RL17.3(CM)
DC12V-18: J11.7 RL18.3(CM)
DC12V-19: J11.9 RL19.3(CM)
DC12V-20: J11.11 RL20.3(CM)
DGND: C1.2 C2.2 C3.2 C4.2 C5.2 C6.2 C7.2 C8.2 C9.2 C10.2 C11.2 C12.1 C13.2 C14.2 C15.2 C16.2 C18.1 C19.1 C20.1 C22.2 C23.2 C25.2 C26.2 C27.1 C28.1 C33.1 C34.2 C35.2 C37.1 C39.2 C40.1 C41.2 C45.2 C46.2 C47.2 C48.2 C53.2 C54.1 C55.1 C62.2 C64.2 C65.2 C66.1 C67.2 C68.1 C70.1 C72.2 C75.1 C81.2 C83.2 C87.2 C88.2 C89.1 C90.1 C91.1 C92.2 C96.2 C98.2 C100.2 C102.2 C103.2 C105.2 C108.1 C109.1 C115.2 C117.2 C119.2 C122.2 C123.1 C126.2 C129.1 C130.1 C133.2 C135.2 C137.2 C139.2 C140.1 C141.1 C142.1 C143.1 C144.1 C145.1 C146.1 C147.1 C149.1 C152.2 C153.2 C154.1 DC1.2 DC2.2 EC1.2 EC2.2 J2.5 J6.5 J6.9 J10.2 J10.6 J12.4 J13.2 J13.4 J13.6 J13.8 L2.2 L3.2 L4.2 Q1.3(E) Q3.3(E) Q4.3(E) Q5.3(E) Q6.3(E) Q7.3(E) Q8.3(E) Q9.3(E) Q10.3(E) Q11.3(E) Q12.3(E) Q13.3(E) Q14.3(E) Q16.3(E) Q18.3(E) Q19.3(E) Q20.3(E) Q21.3(E) Q22.3(E) Q23.3(E) Q24.3(E) Q25.3(E) Q26.3(E) Q27.3(E) Q28.3(E) R5.2 R6.1 R7.2 R33.1 R73.1 R74.1 R75.1 R82.1 R83.1 R84.1 R85.1 R97.1 R106.1 R107.1 R108.1 R111.1 R125.1 R126.1 R134.1 R136.1 R145.1 R157.1 R160.1 R163.1 R178.1 R185.1 R200.1 R205.1 R210.1 R215.1 R218.1 R219.1 R223.1 SW2.1(COMMON) SW3.2 SW4.1(COMMON) TVS6.1 U1.4(GND) U2.3(Gnd) U2.6(G) U3.22(VSSREG) U3.44(VSS) U3.59(VSSREG) U3.65(VSS) U3.79(VSS) U3.103(VSS) U3.117(VSS) U3.119(VSSREG) U3.139(VSS) U4.2(GND) U5.3(GND) U5.4(PFI) U6.2(GND) U7.15(GND) U8.2(GND) U9.2(GND) U10.4(VSS) U15.1(GND) U37.2(A) U38.2(A) U40.2(A) U41.2(A) U43.4(GND) U44.4(GND) UG1.3 UG2.3 UG3.3 UG4.3 UG5.3 UG6.3 UG7.3 UG8.3 UG9.3 UG10.3 UG11.3 UG12.3 UG13.3 UG14.3 UG15.3 UG16.3 UG19.3 UG20.3 UG21.3 UG22.3 UG23.3 UG24.3
DP3V3: C1.1 C2.1 C3.1 C4.1 C5.1 C6.1 C7.1 C8.1 C9.1 C10.1 C11.1 C12.2 C13.1 C14.1 C15.1 C16.1 C22.1 C23.1 C24.1 C25.1 C26.1 C32.2 C33.2 C34.1 C35.1 C39.1 C40.2 C41.1 D7.1 D8.1 D9.1(A) D10.1 D11.1 EC1.1 EC2.1 J2.6 R3.2 R8.2 R9.2 R15.2 R16.2 R18.2 R19.1 R20.1 R21.1 R22.2 R23.2 R26.2 R30.2 R31.2 R47.1 R48.1 R49.1 R50.1 R52.1 R54.1 R59.2 R66.1 R67.1 R76.1 R86.1 R87.1 R91.1 R92.1 R104.1 R113.1 R114.1 R115.1 R120.1 R130.1 R137.2 R148.1 R150.1 R151.1 R176.1 R182.1 R189.1 R191.1 R193.1 R195.1 R196.2 R201.2 R206.2 R211.2 R225.1 R227.1 U2.4(Vout) U3.18(VDD) U3.41(VDD) U3.60(VDD) U3.62(VDD) U3.77(VDD) U3.102(VDD) U3.114(VDD) U3.121(VDD) U3.138(VDD) U4.1(VCC) U5.2(VCC) U6.1(VCC) U7.16(VCC) U8.1(VCC) U9.1(VCC) U10.8(VDD) U43.8(VCC) U44.8(VCC)
FGND: J13.12 L2.1 L3.1
PE: C154.2
SGND: C112.2 C113.2 J1.11 J5.1 J5.12 JP2.1 JP2.5 UG17.3 UG18.3
VA3.3: C42.1 C43.1 C44.1 Q2.3(E) R57.2 U3.14(VDDA) U3.17(VREFP)
VDD5V: C19.2 C20.2 DC2.1 F1.1 J6.12 J10.3 L1.2 Q2.2(C) R2.1 R4.1 R55.2 R220.2 U2.2(Vin)
VDD12V: C18.2 C49.1 C50.1 C51.2 C52.2 C58.1 C59.1 C60.2 C79.1 C84.2 C85.2 C86.2 C93.1 C95.2 C106.2 C107.2 C124.2 C125.2 C127.2 C128.2 C131.2 C148.2 D1.2(K) D2.2(K) D12.2(K) D13.2(K) D14.2(K) D15.2(K) D16.2(K) D17.2(K) D18.2(K) D19.2(K) D20.2(K) D21.2(K) D22.2(K) D23.2(K) D24.2(K) D25.2(K) D26.2(K) D27.2(K) D28.2(K) D29.2(K) D30.2(K) D31.2(K) D32.2(K) DC1.1 J6.8 J10.1 R60.2 R61.2 R62.2 R63.2 R64.2 R81.2 R93.2 R94.2 R95.2 R96.2 R121.2 R122.2 R131.2 R132.2 R135.2 R143.2 R147.2 R155.2 R158.2 R161.2 R221.2 RL1.2(-) RL2.2(-) RL3.2(-) RL4.2(-) RL5.2(-) RL6.2(-) RL7.2(-) RL8.2(-) RL9.2(-) RL10.2(-) RL11.2(-) RL12.2(-) RL13.2(-) RL14.2(-) RL15.2(-) RL16.2(-) RL17.2(-) RL18.2(-) RL19.2(-) RL20.2(-) RL21.2(-) U1.2(Vi) U1.7(EN)
485_CON1: U3.134(P4[31]/EMC_CS1) U4.5(485_CON)
485_CON2: U3.130(P4[30]/EMC_CS0) U6.5(485_CON)
A1: J9.6 RL11.4(RO)
A2: J9.8 RL12.4(RO)
A3: J9.10 RL13.4(RO)
A4: J9.12 RL14.4(RO)
A5: J11.2 RL15.4(RO)
A6: J11.4 RL16.4(RO)
A7: J11.6 RL17.4(RO)
A8: J11.8 RL18.4(RO)
A9: J11.10 RL19.4(RO)
A10: J11.12 RL20.4(RO)
A12-RL: JP1.4 RL1.4(RO)
A24-RL: JP1.6 RL4.4(RO)
AAC-RL: J8.2 RL8.4(RO)
ADC1-RL: J8.4 RL5.4(RO)
ADC2_RL: J8.6 RL9.4(RO)
ADC_CC1: U3.30(P1[30]/USB_PWRD2/USB_VBUS/ADC0_IN4/I2C0_SDA/U3_OE)
ADC_CC2: U3.28(P1[31]/USB_OVRCR2/SSP1_SCK/ADC0_IN5/I2C0_SCL)
ADD1: R68.1 U3.55(P4[1]/EMC_A[1])
ADD2: R70.1 U3.45(P3[23]/EMC_D[23]/PWM1_CAP0/T0_CAP0)
ADD3: R69.1 U3.48(P0[14]/USB_HSTEN2/SSP1_SSEL/USB_CONNECT2)
ADD4: R133.1 U3.52(P4[0]/EMC_A[0])
ADD5: R144.1 U3.58(P4[2]/EMC_A[2])
ADD6: R146.1 U3.68(P4[3]/EMC_A[3])
ADD7: R149.1 U3.71(P2[13]/EINT3/SD_DAT[3]/I2S_TX_SDA)
ADD8: R156.1 U3.73(P2[12]/EINT2/SD_DAT[2]/I2S_TX_WS)
ADD9: R159.1 U3.74(P4[5]/EMC_A[5])
ADD10: R162.1 U3.75(P2[11]/EINT1/SD_DAT[1]/I2S_TX_SCK)
AGND: C42.2 C43.2 C44.2 L4.1 R58.1 U3.15(VSSA) U11.2(A)
B12_RL: J8.8 RL3.4(RO)
B24-RL: J8.10 RL2.4(RO)
BAC_RL: J8.12 RL6.4(RO)
BDC1-RL: J9.2 RL7.4(RO)
BDC2_RL: J9.4 RL10.4(RO)
CAN_RD1: R56.2 U3.82(P0[21]/U1_RI/SD_PWR/U4_OE/CAN_RD1/U4_SCLK) U9.4(RD)
CAN_RD2: R41.2 U3.95(P2[7]/CAN_RD2/U1_RTS) U8.4(RD)
CAN_TD1: R51.2 U3.80(P0[22]/U1_RTS/SD_DAT0/U4_TXD/CAN_TD1) U9.3(TD)
CAN_TD2: R38.2 U3.93(P2[8]/CAN_TD2/U2_TXD/U1_CTS/ENET_MDC) U8.3(TD)
CANH1: J7.6 J7.8 R39.2 TVS7.1 U8.6(CANH)
CANH2: J7.2 J7.4 R53.2 TVS11.1 U9.6(CANH)
CANL1: J7.5 J7.7 R39.1 TVS5.2 TVS7.2 U8.7(CANL)
CANL2: J7.1 J7.3 R53.1 TVS10.2 TVS11.2 U9.7(CANL)
CON-C: C141.2 R199.1 R200.2 U3.8(P0[26]/ADC0_IN3/DAC_OUT/U3_RXD)
CON-D: C143.2 R204.1 R205.2 U3.10(P0[25]/ADC0_IN2/I2S_RX_SDA/U3_TXD)
CON-E: C144.2 R209.1 R210.2 U3.11(P0[24]/ADC0_IN1/I2S_RX_WS/T3_CAP1)
CON-F: C145.2 R214.1 R215.2 U3.13(P0[23]/AD0_IN0/I2S_RX_SCK/T3_CAP0)
DO1: R77.1 U3.38(P3[26]/EMC_D[26]/PWM1[3]/T0_MAT1/STCLK)
DO2: R80.1 U3.39(P3[25]/EMC_D[25]/PWM1[2]/T0_MAT0)
DO3: R102.1 U3.40(P3[24]/EMC_D[24]/PWM1[1]/T0_CAP1)
DO4: R98.1 U3.42(P0[29]/USB_D+1/EINT0)
DO5: R123.1 U3.43(P0[30]/USB_D-1/EINT1)
DO6: R78.1 U3.46(P1[18]/USB_UP_LED1/PWM1[1]/T1CAP0/SSP1_MISO)
DO7: R79.1 U3.47(P1[19]/USB_TX_E1/USB_PPWR1/T1_CAP1/MC_0A/SSP1_SCK/U2_OE)
DO8: R99.1 U3.49(P1[20]/USB_TX_DP1/PWM1[2]/QEI_PHA/MC_FB0/SSP0_SCK)
DO9: R100.1 U3.50(P1[21]/USB_TX_DM1/PWM1[3]/SSP0_SSEL/MC_ABORT)
DO10: R124.1 U3.51(P1[22]/USB_RCV1/USB_PWRD1/T1_MAT0/MC_0B/_SSP1_MOSI)
E-L1: C112.1 J1.12 Q15.2(D)
E-L2: C113.1 J1.10 Q17.2(D)
ERROR_1: R177.2 U3.112(P0[7]/I2S_TX_SCK/SSP1_SCK/T2_MAT1/RTC_EV0)
ERROR_2: R184.2 U3.113(P0[6]/I2S_RX_SDA/SSP1_SSEL/T2_MAT0/U1_RTS)
FAN+: JP1.1 RL21.3(CM)
FAN-: JP1.2 RL21.4(RO)
FAN-switch: R222.1 U3.29(P0[12]/USB_PPWR2/SSP1_MISO/ADC0_IN6)
FRAM_CS: R52.2 U3.90(P0[16]/U1_RXD/SSP0_SSEL) U10.1(~{CS})
FRAM_MISO: R50.2 U3.87(P0[17]/U1_CTS/SSP0_MISO) U10.2(SO)
FRAM_MOSI: R49.2 U3.86(P0[18]/U1_DCD/SSP0_MOSI) U10.5(SI)
FRAM_SCK: R48.2 U3.89(P0[15]/U1_TXD/SSP0_SCK) U10.6(SCK)
IN1: J5.2 R119.1
ISP: R15.1 SW2.2(NO) U3.76(P2[10]/EINT0/NMI)
MODE1: R59.1 SW4.2(NO) U3.72(P4[4]/EMC_A[4])
NCT-IN1: C62.1 R66.2 U3.54(P1[24]/USB_RX_DM1/PWM1[5]/QEI_IDX/MC_FB2/SSP0_MOSI) UG1.4
NCT-IN2: C64.1 R67.2 U3.56(P1[25]/USB_LS1/USB_HSTEN1/T1_MAT1/MC_1A/CLKOUT) UG2.4
NCT-IN3: C81.1 R91.2 U3.57(P1[26]/USB_SSPND1/PWM1[6]/T0_CAP0/MC_1B/SSP1_SSEL) UG3.4
NCT-IN4: C83.1 R92.2 U3.61(P1[27]/USB_INT1/USB_OVRCR1/T0_CAP1/CLKOUT) UG4.4
NCT-IN5: C98.1 R113.2 U3.63(P1[28]/USB_SCL1/PWM1_CAP0/T0_MAT0/MC_2A/SSP0_SSEL) UG5.4
NCT-IN6: C103.1 R114.2 U3.64(P1[29]/USB_SDA1/PWM1_CAP1]/T0_MAT1/MC_2B/U4_TXD) UG6.4
NCT-IN7: C92.1 R120.2 U3.83(P0[20]/U1_DTR/SD_CMD/I2C1_SCL) UG8.4
NCT-IN8: C96.1 R130.2 U3.84(P4[7]/EMC_A[7]) UG9.4
NCT-IN9: C72.1 R87.2 U3.85(P0[19]/U1_DSR/SD_CLK/I2C1_SDA) UG10.4
NCT-IN10: C100.1 R104.2 U3.91(P4[9]/EMC_A[9]) UG11.4
NCT-IN11: C102.1 R76.2 U3.92(P2[9]/USB_CONNECT1/U2_RXD/U4_RXD/ENET_MDIO) UG12.4
NCT-IN12: C87.1 R86.2 U3.108(P4[13]/EMC_A[13]) UG13.4
NCT-IN13: C115.1 R148.2 U3.109(P0[9]/I2S_TX_SDA/SSP1_MOSI/T2_MAT3/RTC_EV2) UG14.4
NCT-IN14: C117.1 R150.2 U3.110(P4[14]/EMC_A[14]) UG15.4
NCT-IN15: C119.1 R151.2 U3.111(P0[8]/I2S_TX_WS/SSP1_MISO/T2_MAT2/RTC_EV1) UG16.4
NCT-IN16: C133.1 R189.2 U3.105(P2[2]/PWM1[3]/U1_CTS/T2_MAT3/TRACEDATA[3]) UG19.4
NCT-IN17: C135.1 R191.2 U3.104(P4[12]/EMC_A[12]) UG20.4
NCT-IN18: C137.1 R193.2 U3.100(P2[3]/PWM1[4]/U1_DCD/T2_MAT2/TRACEDATA[2]) UG21.4
NCT-IN19: C152.1 R225.2 U3.97(P2[5]/PWM1[6]/U1_DTR/T2_MAT0/TRACEDATA[0]) UG23.4
NCT-IN20: C153.1 R227.2 U3.94(P4[10]/EMC_A[10]) UG24.4
NCT-IN21: C139.1 R195.2 U3.99(P2[4]/PWM1[5]/U1_DSR/T2_MAT1/TRACEDATA[1]) UG22.4
nRST: C28.2 J2.1 R21.2 R26.1 R27.2 U3.24(RESET)
RTCK1: C45.1 U3.23(RTCX1) Y1.1
RTCK2: C47.1 U3.25(RTCX2) Y1.2
Run: R29.1 U3.96(P2[6]/PWM1_CAP0/U1_RI/T2_CAP0/U2_OE/TRACECELK)
run_buzzer: R110.2 U3.78(P4[6]/EMC_A[6])
STOP_TEST: C105.1 R115.2 U3.53(P1[23]/USB_RX_DP1/PWM1[4]/QEI_PHB/MC_FB1/SSP0_MISO) UG7.4
sw0: C17.1 L1.1 U1.3(SW)
TCK: J2.3 R30.1 U3.7(JTAG_TCK)
TDO: J2.2 R137.1 U3.1(JTAG_TDO)
temp_C: C140.2 J13.1 R197.1 R198.1 U43.3(IN+)
temp_D: C142.2 J13.3 R202.1 R203.1 U43.5(IN+)
temp_E: C146.2 J13.5 R207.1 R208.1 U44.3(IN+)
temp_F: C147.2 J13.7 R212.1 R213.1 U44.5(IN+)
TMS: J2.4 R31.1 U3.4(JTAG_TMS)
U0-RX: J6.11 R138.2
U0-RXD: R40.1 U3.142(P0[3]/U0_RXD/U3_RXD)
U0-TX: J6.10 R139.2
U0-TXD: R43.1 U3.141(P0[2]/U0_TXD/U3_TXD)
U1-RX: J6.7 R37.2 TVS6.2 TVS8.2
U1-TX: J6.6 R45.2 TVS8.1
U1_RXD: D5.2 R34.1 U3.106(P2[1]/PWM1[2]/U1_RXD)
U1_TXD: D6.2 R32.1 U3.107(P2[0]/PWM1[1]/U1_TXD)
U2_RXD: R141.2 U3.70(P0[11]/U2_RXD/I2C2_SCL/T3_MAT1)
U2_TXD: R140.2 U3.69(P0[10]/U2_TXD/I2C2_SDA/T3_MAT0)
U3_485A: J6.2 J6.4 R11.2 TVS2.2
U3_485B: J6.1 J6.3 R14.2 TVS1.2 TVS2.1
U3_RXD: R42.1 U3.122(P4[29]/EMC_BLS3/U3_RXD/T2_MAT1/I2C2_SCL)
U3_TXD: R44.1 U3.118(P4[28]/EMC_ABLS2/U3_TXD/T2_MAT0)
U4_485A: J7.10 J7.12 R28.2 TVS4.2
U4_485B: J7.9 J7.11 R35.2 TVS3.2 TVS4.1
U4_RXD: D3.2 R13.1 U3.98(P5[3]/U4_RXD//I2C0_SCL)
U4_TXD: D4.2 R12.1 U3.143(P5[4]/U0_OE/T3_MAT3/U4_TXD)
USBD2+: R217.2 U3.36(P0[31]/USB_D+2)
USBD2-: R216.2 U3.37(USB_D-2)
WDI: R19.2 U3.35(P0[27]/I2C0_SDA/USB_SDA1) U5.6(WDI)
XTAL1: C46.1 U3.31(XTAL1) Y2.2
XTAL2: C48.1 U3.33(XTAL2) Y2.1
Y1-in: J5.3 R71.1
Y2-in: J5.4 R72.1
Y3-in: J5.5 R89.1
Y4-in: J5.6 R90.1
Y5-in: J5.7 R117.1
Y6-in: J5.8 R118.1
Y7-in: J5.9 R129.1
Y8-in: J5.10 R127.1
Y9-in: J5.11 R128.1
Y10-in: JP2.2 R103.1
Y11-in: JP2.3 R105.1
Y12-in: J1.6 R142.1
Y13-in: J1.7 R152.1
Y14-in: J1.8 R153.1
Y15-in: J1.9 R154.1
Y16-in: J1.5 R188.1
Y17-in: J1.4 R190.1
Y18-in: J1.3 R192.1
Y19-in: J1.1 R224.1
Y20-in: JP2.4 R226.1
Y21-in: J1.2 R194.1
NetC17_2: C17.2 U1.1(BS)
NetC21_1: C21.1 U1.6(comp)
NetC21_2: C21.2 R7.1
NetC24_2: C24.2 R18.1 SW1.1(COMMON) SW3.1 U5.1(~{MR})
NetC27_2: C27.2 R20.2 R27.1 U5.7(~{RST})
NetC30_1: C30.1 R36.1 TVS5.1
NetC30_2: C30.2 R36.2 U8.8(RG)
NetC31_1: C31.1 U7.3(C-)
NetC31_2: C31.2 U7.1(C1+)
NetC32_1: C32.1 U7.2(V+)
NetC36_1: C36.1 U7.5(C2-)
NetC36_2: C36.2 U7.4(C2+)
NetC37_2: C37.2 U7.6(V-)
NetC38_1: C38.1 R46.1 U9.8(RG)
NetC38_2: C38.2 R46.2 TVS10.1
NetC49_2: C49.2 D12.1(A) LED2.2 Q3.2(C) RL1.1(+)
NetC50_2: C50.2 D13.1(A) LED3.2 Q4.2(C) RL2.1(+)
NetC51_1: C51.1 D14.1(A) LED4.2 Q5.2(C) RL3.1(+)
NetC52_1: C52.1 D15.1(A) LED5.2 Q6.2(C) RL4.1(+)
NetC53_1: C53.1 Q13.1(B) R68.2 R75.2
NetC54_2: C54.2 Q18.1(B) R70.2 R74.2
NetC55_2: C55.2 Q19.1(B) R69.2 R134.2
NetC58_2: C58.2 D29.1(A) LED19.2 Q24.2(C) RL18.1(+)
NetC59_2: C59.2 D26.1(A) LED16.2 Q21.2(C) RL15.1(+)
NetC60_1: C60.1 D31.1(A) LED21.2 Q26.2(C) RL20.1(+)
NetC61_2: C61.2 R71.2 UG1.2
NetC63_2: C63.2 R72.2 UG2.2
NetC65_1: C65.1 Q3.1(B) R77.2 R83.2
NetC66_2: C66.2 Q6.1(B) R80.2 R84.2
NetC67_1: C67.1 Q4.1(B) R79.2 R85.2
NetC68_2: C68.2 Q5.1(B) R78.2 R82.2
NetC70_2: C70.2 Q22.1(B) R97.2 R146.2
NetC71_1: C71.1 R128.2 UG10.2
NetC75_2: C75.2 Q20.1(B) R133.2 R136.2
NetC76_1: C76.1 R103.2 UG11.2
NetC77_1: C77.1 R129.2 UG8.2
NetC79_2: C79.2 D17.1(A) LED6.2 Q7.2(C) RL5.1(+)
NetC80_2: C80.2 R89.2 UG3.2
NetC82_2: C82.2 R90.2 UG4.2
NetC84_1: C84.1 D18.1(A) LED7.2 Q8.2(C) RL6.1(+)
NetC85_1: C85.1 D19.1(A) LED8.2 Q9.2(C) RL7.1(+)
NetC86_1: C86.1 D20.1(A) LED9.2 Q10.2(C) RL8.1(+)
NetC88_1: C88.1 Q7.1(B) R98.2 R107.2
NetC89_2: C89.2 Q9.1(B) R100.2 R108.2
NetC90_2: C90.2 Q8.1(B) R99.2 R106.2
NetC91_2: C91.2 Q10.1(B) R102.2 R111.2
NetC93_2: C93.2 D23.1(A) LED12.2 Q13.2(C) RL11.1(+)
NetC94_1: C94.1 R127.2 UG9.2
NetC95_1: C95.1 D16.1(A) LED13.2 Q18.2(C) RL12.1(+)
NetC97_1: C97.1 R117.2 UG5.2
NetC99_1: C99.1 R118.2 UG6.2
NetC101_1: C101.1 R105.2 UG12.2
NetC104_1: C104.1 R119.2 UG7.2
NetC106_1: C106.1 D21.1(A) LED10.2 Q11.2(C) RL9.1(+)
NetC107_1: C107.1 D22.1(A) LED11.2 Q12.2(C) RL10.1(+)
NetC108_2: C108.2 Q11.1(B) R123.2 R125.2
NetC109_2: C109.2 Q12.1(B) R124.2 R126.2
NetC110_1: C110.1 R176.2 UG17.1
NetC110_2: C110.2 Q14.1(B) R177.1 R178.2
NetC111_1: C111.1 R182.2 UG18.1
NetC111_2: C111.2 Q16.1(B) R184.1 R185.2
NetC114_1: C114.1 R152.2 UG14.2
NetC116_1: C116.1 R153.2 UG15.2
NetC118_1: C118.1 R154.2 UG16.2
NetC121_1: C121.1 R142.2 UG13.2
NetC122_1: C122.1 Q24.1(B) R156.2 R157.2
NetC123_2: C123.2 Q23.1(B) R73.2 R149.2
NetC124_1: C124.1 D28.1(A) LED18.2 Q23.2(C) RL17.1(+)
NetC125_1: C125.1 D27.1(A) LED17.2 Q22.2(C) RL16.1(+)
NetC126_1: C126.1 Q21.1(B) R144.2 R145.2
NetC127_1: C127.1 D25.1(A) LED15.2 Q20.2(C) RL14.1(+)
NetC128_1: C128.1 D24.1(A) LED14.2 Q19.2(C) RL13.1(+)
NetC129_2: C129.2 Q26.1(B) R162.2 R163.2
NetC130_2: C130.2 Q25.1(B) R159.2 R160.2
NetC131_1: C131.1 D30.1(A) LED20.2 Q25.2(C) RL19.1(+)
NetC132_1: C132.1 R188.2 UG19.2
NetC134_1: C134.1 R190.2 UG20.2
NetC136_1: C136.1 R192.2 UG21.2
NetC138_1: C138.1 R194.2 UG22.2
NetC148_1: C148.1 D32.1(A) LED23.2 Q27.2(C) RL21.1(+)
NetC149_2: C149.2 Q27.1(B) R222.2 R223.2
NetC150_1: C150.1 R224.2 UG23.2
NetC151_1: C151.1 R226.2 UG24.2
NetD3_1: D3.1 R8.1
NetD4_1: D4.1 R9.1
NetD5_1: D5.1 R22.1
NetD6_1: D6.1 R23.1
NetD7_2: D7.2 R41.1
NetD8_2: D8.2 R38.1
NetD9_2: D9.2(K) U3.27(VBAT)
NetD10_2: D10.2 R56.1
NetD11_2: D11.2 R51.1
NetD33_1: D33.1(A) Q28.2(C) U12.2(B)
NetD33_2: D33.2(K) R220.1 U12.1(A)
NetF1_2: F1.2 J12.1 U15.4(VCC)
NetJ10_4: J10.4 R140.1
NetJ10_5: J10.5 R141.1
NetJ12_2: J12.2 R216.1 R218.2 U15.2(I/O1)
NetJ12_3: J12.3 R217.1 R219.2 U15.3(I/O2)
NetLED1_1: LED1.1 R16.1
NetLED1_2: LED1.2 Q1.2(C)
NetLED2_1: LED2.1 R60.1
NetLED3_1: LED3.1 R61.1
NetLED4_1: LED4.1 R63.1
NetLED5_1: LED5.1 R62.1
NetLED6_1: LED6.1 R93.1
NetLED7_1: LED7.1 R94.1
NetLED8_1: LED8.1 R95.1
NetLED9_1: LED9.1 R96.1
NetLED10_1: LED10.1 R121.1
NetLED11_1: LED11.1 R122.1
NetLED12_1: LED12.1 R131.1
NetLED13_1: LED13.1 R132.1
NetLED14_1: LED14.1 R64.1
NetLED15_1: LED15.1 R135.1
NetLED16_1: LED16.1 R143.1
NetLED17_1: LED17.1 R81.1
NetLED18_1: LED18.1 R147.1
NetLED19_1: LED19.1 R155.1
NetLED20_1: LED20.1 R158.1
NetLED21_1: LED21.1 R161.1
NetLED23_1: LED23.1 R221.1
NetQ1_1: Q1.1(B) R29.2 R33.2
NetQ2_1: Q2.1(B) R55.1 U11.3(C)
NetQ14_2: Q14.2(C) UG17.2
NetQ15_1: Q15.1(G) R183.2
NetQ16_2: Q16.2(C) UG18.2
NetQ17_1: Q17.1(G) R187.2
NetQ28_1: Q28.1(B) R110.1
NetR1_1: R1.1 R4.2
NetR1_2: R1.2 R5.1 U1.5(FB)
NetR2_2: R2.2 U2.1(EN)
NetR3_1: R3.1 R6.2 U2.5(Adj)
NetR10_1: R10.1 U4.10(RG)
NetR10_2: R10.2 TVS1.1
NetR11_1: R11.1 U4.9(CANL/485A)
NetR12_2: R12.2 U4.3(TXD)
NetR13_2: R13.2 U4.4(RXD)
NetR14_1: R14.1 U4.8(CANH/485B)
NetR24_1: R24.1 U6.10(RG)
NetR24_2: R24.2 TVS3.1
NetR28_1: R28.1 U6.9(CANL/485A)
NetR32_2: R32.2 U6.3(TXD)
NetR34_2: R34.2 U6.4(RXD)
NetR35_1: R35.1 U6.8(CANH/485B)
NetR37_1: R37.1 U7.8(R2IN)
NetR40_2: R40.2 U7.12(R1OUT)
NetR42_2: R42.2 U7.9(R2OUT)
NetR43_2: R43.2 U7.11(T1IN)
NetR44_2: R44.2 U7.10(T2IN)
NetR45_1: R45.1 U7.7(T2OUT)
NetR47_2: R47.2 U10.7(~{HOLD})
NetR54_2: R54.2 U10.3(~{WP})
NetR57_1: R57.1 R58.2 U11.1(R)
NetR138_1: R138.1 U7.13(R1IN)
NetR139_1: R139.1 U7.14(T1OUT)
NetR179_1: R179.1 R183.1 UG17.4
NetR186_1: R186.1 R187.1 UG18.4
NetR196_1: R196.1 R197.2 R198.2 U37.1(R) U37.3(C)
NetR199_2: R199.2 U43.1(OUT) U43.2(IN-)
NetR201_1: R201.1 R202.2 R203.2 U38.1(R) U38.3(C)
NetR204_2: R204.2 U43.6(IN-) U43.7(OUT)
NetR206_1: R206.1 R207.2 R208.2 U40.1(R) U40.3(C)
NetR209_2: R209.2 U44.1(OUT) U44.2(IN-)
NetR211_1: R211.1 R212.2 R213.2 U41.1(R) U41.3(C)
NetR214_2: R214.2 U44.6(IN-) U44.7(OUT)
NetSW1_2: SW1.2(NO) U5.8(~{WDO})

Not connected (* = marked no-connect by the designer): J12 5; J13 9 10; MAKE1 1; MARKE1 1; MARKE3 1; U1 8(SS); U3 2(P3[3]/EMC_D[3]) 3(JTAG_TDI) 5(JTAG_TRST) 6(P5[0]/EMC_A[24]/SSP2_MOSI/T2_MAT2) 9(P3[4]/EMC_D[4]) 12(P3[5]/EMC_D[5]) 16(P3[6]/EMC_D[6]) 19(P3[7]/EMC_D[7]) 20(RSTOUT) 21(P5[1]/EMC_BLS3/U3_RXD/T2_MAT1/I2C2_SCL) 26(RTC_ALARM) 32(P0[13]/USB_UP_LED2/SSP1_MOSI/ADC0_IN7) 34(P0[28]/I2C0_SCL/USB_SCL1) 66(P0[0]/CAN_RD1/U3_TXD/I2C1_SDA/U0_TXD) 67(P0[1]/CAN_TD1/U3_RXD/I2C1_SCL/U0_RXD) 81(P5[2]/T3_MAT2/I2C0/SDA) 88(P4[8]/EMC_A[8]) 101(P4[11]/EMC_A[11]) 115(P0[5]/I2S_RX_WS/TD2/T2CAP1) 116(P0[4]/I2C_RX_SCK/RD2/T2_CAP0) 120(P4[15]/EMC_A[15]) 123(P1[17]/ENET_MDIO/I2S_RX_MCLK) 124(P4[25]/EMC_WE) 125(P1[16]/ENET_MDC/I2S_TX_MCLK) 126(P1[15]/ENET_RX_CLK/I2C2_SDA) 127(P4[24]/EMC_OE) 128(P1[14]/ENET_RX_ER/T2_CAP0) 129(P1[10]/ENET_RXD1/T3_CAP0) 131(P1[9]/ENET_RXD0/T3_MAT0) 132(P1[8]/ENET_CRS/T3_MAT1/SSP2_SSEL) 133(P1[4]/ENET_TX_EN/T3_MAT2/SSP2_MISO) 135(P1[1]/ENET_TXD1/T3_MAT3/SSP2_MOSI) 136(P1[0]/ENET_TXD0/T3_CAP1/SSP2_SCK) 137(P3[0]/EMC_D[0]) 140(P3[1]/EMC_D[1]) 144(P3[2]/EMC_D[2]); U5 5(~{PFO})*

## Notes on the sheet
- 看门狗复位电路
- 蜂鸣器电路
- ISP电路
- 运行指示灯
- 1，F1为可恢复保险管SMD0.5A/0805
- 铁电数据存储
- AD转换参照电压
- 增加10路
- 晶振电路
- (near Q15) S
- (near Q15) D
- (near Q17) S
- (near Q17) D
- (near J13) 温度检测
- Labels drawn without touching a wire or pin: USB_LED
- (in symbol CAPACITOR POL) +

## Library data of the parts
C1-C16 C41 C45-C48 = CAP1
C17 C18 C21 = CAP
C19 C20 C31-C33 C35-C37 C40 C42 C43 C49 C50 C53 C58 C59 C61-C65 C67 C71 C72 C76 C77 C79-C83 C87 C88 C92-C94 C96-C105 C110-C119 C121 C122 C126 C132-C140 C142 C146 C147 C150-C153 = CAP: Capacitor
C22 C24 C25 C27 C28 = CAP1: CAP
C23 C26 = CAP_1
C30 C38 C154 = 0.1uF: C0603; Published: *; LatestRevisionDate: *; LatestRevisionNote: *; Publisher: *; Value: *
C34 C39 C44 DC1 DC2 EC1 = CAP2
C51 C52 C54 C55 C60 C66 C68 C70 C75 C84-C86 C89-C91 C95 C106-C109 C123-C125 C127-C131 C148 C149 = Cap: Capacitor; Published: *; LatestRevisionDate: *; LatestRevisionNote: *; PackageReference: *; Publisher: *; Value: *
C141 C143-C145 = CAP1: Capacitor
D1 D2 D9 D12-D33 = DIODE
D3-D8 D10 D11 LED1-LED21 LED23 = LED
EC2 = CAPACITOR POL: Capacitor
F1 = FUSE1: Fuse
J1 J5-J9 J11 J13 = CON12
J2 J10 = CON6: Connector
J12 = CON5: Connector
L1-L4 = INDUCTOR
MAKE1 MARKE1 MARKE3 = CON1: Connector
Q1-Q14 Q16 Q18-Q28 = NPN
Q15 Q17 = PMOS
R1 R4 R5 R7 = R_S
R2 R3 R6 R16 R18-R21 R26 R27 R29-R31 R33 R47-R50 R52 R54 R55 R57-R64 R66-R87 R89-R100 R102 R104 R106-R108 R111 R113-R115 R120-R126 R130-R137 R140 R141 R143-R151 R155-R163 R176-R179 R182-R187 R189 R191 R193 R195 R197-R200 R202-R205 R207-R210 R212-R215 R221-R223 R225 R227 = RES1
R8-R15 R22-R24 R28 R32 R34 R35 R37 R40 R42-R45 R103 R105 R110 R117-R119 R127-R129 R138 R139 R142 R152-R154 R188 R190 R192 R194 R196 R201 R206 R211 R220 R224 R226 = RES-1: RES
R36 R38 R39 R41 R51 R53 R56 R216-R219 = RES2
  R36: 物料: *; Value: 1M; 规: *; RoHS: *; 贴片: *; ComponentLink1Description: *; ComponentLink1URL: *; 现有: *
  R39 R53: 物料: *; Value: 120R; 规: *; RoHS: *; 贴片: *; ComponentLink1Description: *; ComponentLink1URL: *; 现有: *
R46 = RES2: 物料: 1.01.03.0019; 规: 1MΩ,1206,RoHS; 贴片: SMT; 现有: 16230; RoHS: RoHS; ComponentLink1Description: ErpDataInfo; ComponentLink1URL: http://192.168.0.2:8012/ErpExt/ErpData/ListMateriel.aspx?pkey=1.01.03.0019
RL1-RL21 = JQ1P-12V
SW3 = SW-PB
TVS1 TVS3 TVS5 TVS6 TVS10 = TVS-D
TVS2 TVS4 TVS7 TVS8 TVS11 = TVS
U3 = LPC1778LQFP144
U7 = MAX232ESE
U11 = TL431: TL431,SOT23/ST/ON
U15 = PRTR5V0U2X_1
U43 U44 = AS358P-E1
UG1-UG24 = PS2501-1
Y1 Y2 = CRYSTAL